# Altium project RTM_4SFP_3QSFP.PrjPcb (part 1 of 2)
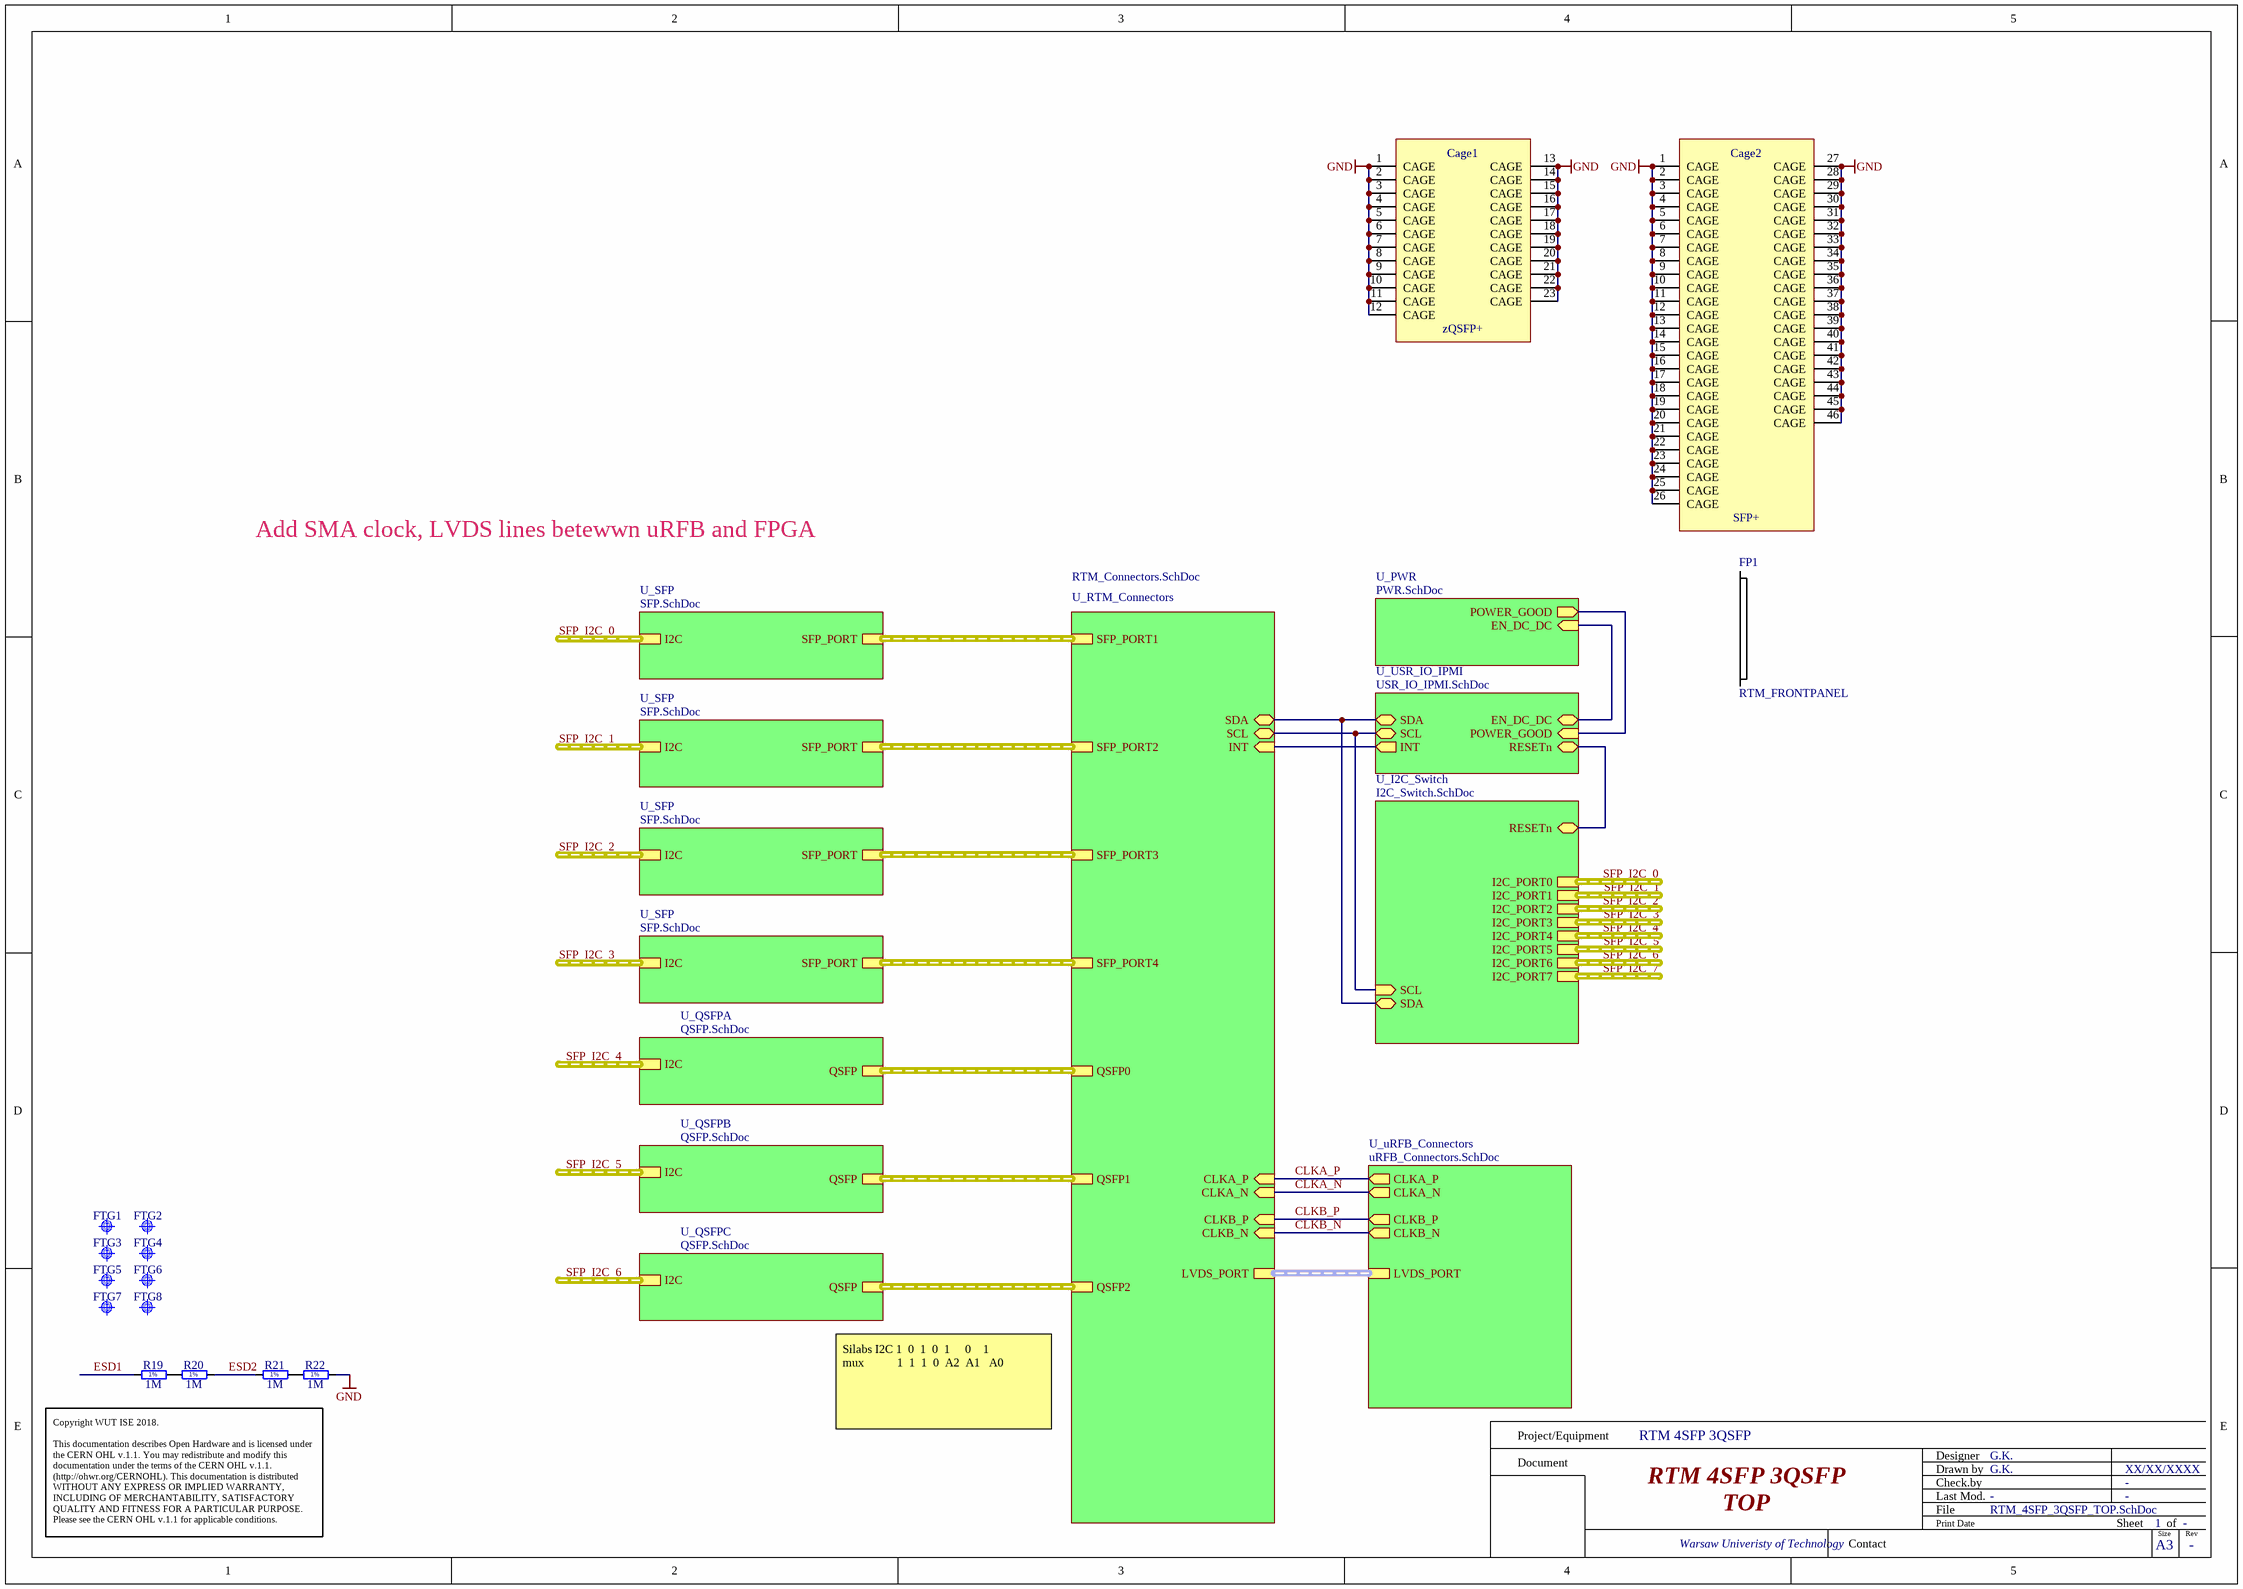
[diagram p0: RTM_4SFP_3QSFP_TOP.SchDoc]
8 sheets, 275 parts. Net scope: hierarchical (ports join the sheet entries above them; power ports are global).
Board file: RTM_4SFP_3QSFP.PcbDoc
Sheets:
  RTM_4SFP_3QSFP_TOP.SchDoc
    U_SFP = SFP.SchDoc
    U_I2C_Switch = I2C_Switch.SchDoc
    U_SFP = SFP.SchDoc
    U_SFP = SFP.SchDoc
    U_SFP = SFP.SchDoc
    U_RTM_Connectors = RTM_Connectors.SchDoc
    U_USR_IO_IPMI = USR_IO_IPMI.SchDoc
    U_uRFB_Connectors = uRFB_Connectors.SchDoc
    U_QSFPA = QSFP.SchDoc
    U_QSFPB = QSFP.SchDoc
    U_QSFPC = QSFP.SchDoc
    U_PWR = PWR.SchDoc

## Sheet RTM_4SFP_3QSFP_TOP.SchDoc: RTM 4SFP 3QSFP
size 420 x 297 mm; Author: G.K.; CompanyName: WUT; DrawnBy: G.K.; Organization: CERN; Address1: Warsaw Univeristy of Technology; Address2: Nowowiejska 15/19; DocumentNumber: 1; Revision: -; SheetNumber: 1; SheetTotal: -; EDA_Number: ARTIQ; Projet: RTM 4SFP 3QSFP; ModifiedBy: -; CreateDate: XX/XX/XXXX; CheckedDate: -; Title2: TOP; DivGrp: ISE; Designer: G.K.; ModifiedDate: -; ProjectName: RTM 4SFP 3QSFP

### Parts
Cage1  zQSFP+  [TYCO_2170737-1]
Cage2  SFP+  [TYCO_2007132-1]
FP1  RTM_FRONTPANEL  [RTM_FRONTPANEL]
FTG1  Use only in PCB  [FIDUCIAL_TOP_S100-200]  (value not drawn)
FTG2  Use only in PCB  [FIDUCIAL_TOP_S100-200]  (value not drawn)
FTG3  Use only in PCB  [FIDUCIAL_TOP_S100-200]  (value not drawn)
FTG4  Use only in PCB  [FIDUCIAL_TOP_S100-200]  (value not drawn)
FTG5  Use only in PCB  [FIDUCIAL_TOP_S100-200]  (value not drawn)
FTG6  Use only in PCB  [FIDUCIAL_TOP_S100-200]  (value not drawn)
FTG7  Use only in PCB  [FIDUCIAL_TOP_S100-200]  (value not drawn)
FTG8  Use only in PCB  [FIDUCIAL_TOP_S100-200]  (value not drawn)
R19  1M  [RESC3216X65N]
R20  1M  [RESC3216X65N]
R21  1M  [RESC3216X65N]
R22  1M  [RESC3216X65N]

### Sub-sheets
U_I2C_Switch = I2C_Switch.SchDoc: I2C_PORT5 (harness I2C), I2C_PORT2 (harness I2C), I2C_PORT1 (harness I2C), I2C_PORT4 (harness I2C), I2C_PORT3 (harness I2C), I2C_PORT7 (harness I2C), I2C_PORT6 (harness I2C), I2C_PORT0 (harness I2C), SDA (bidir), SCL (in), RESETn (bidir)
U_PWR = PWR.SchDoc: POWER_GOOD (out), EN_DC_DC (in)
U_QSFPA = QSFP.SchDoc: QSFP (harness FP), I2C (harness I2C)
U_QSFPB = QSFP.SchDoc: QSFP (harness FP), I2C (harness I2C)
U_QSFPC = QSFP.SchDoc: QSFP (harness FP), I2C (harness I2C)
U_RTM_Connectors = RTM_Connectors.SchDoc: SFP_PORT4 (harness SFP_PORT), SFP_PORT3 (harness SFP_PORT), SFP_PORT2 (harness SFP_PORT), SFP_PORT1 (harness SFP_PORT), SDA (bidir), SCL (bidir), INT (in), QSFP0 (harness FP), QSFP1 (harness FP), QSFP2 (harness FP), CLKA_P (in), CLKA_N (in), CLKB_P (in), CLKB_N (in), LVDS_PORT (harness LVDS_PORT)
U_SFP = SFP.SchDoc: I2C (harness I2C), SFP_PORT (harness SFP_PORT)
U_SFP = SFP.SchDoc: SFP_PORT (harness SFP_PORT), I2C (harness I2C)
U_SFP = SFP.SchDoc: SFP_PORT (harness SFP_PORT), I2C (harness I2C)
U_SFP = SFP.SchDoc: SFP_PORT (harness SFP_PORT), I2C (harness I2C)
U_uRFB_Connectors = uRFB_Connectors.SchDoc: CLKB_P (out), CLKA_N (out), CLKA_P (out), CLKB_N (out), LVDS_PORT (harness LVDS_PORT)
U_USR_IO_IPMI = USR_IO_IPMI.SchDoc: SDA (bidir), SCL (bidir), INT (out), EN_DC_DC (bidir), POWER_GOOD (in), RESETn (bidir)

### Nets
GND: Cage1.1(CAGE) Cage1.2(CAGE) Cage1.3(CAGE) Cage1.4(CAGE) Cage1.5(CAGE) Cage1.6(CAGE) Cage1.7(CAGE) Cage1.8(CAGE) Cage1.9(CAGE) Cage1.10(CAGE) Cage1.11(CAGE) Cage1.12(CAGE) Cage1.13(CAGE) Cage1.14(CAGE) Cage1.15(CAGE) Cage1.16(CAGE) Cage1.17(CAGE) Cage1.18(CAGE) Cage1.19(CAGE) Cage1.20(CAGE) Cage1.21(CAGE) Cage1.22(CAGE) Cage1.23(CAGE) Cage2.1(CAGE) Cage2.2(CAGE) Cage2.3(CAGE) Cage2.4(CAGE) Cage2.5(CAGE) Cage2.6(CAGE) Cage2.7(CAGE) Cage2.8(CAGE) Cage2.9(CAGE) Cage2.10(CAGE) Cage2.11(CAGE) Cage2.12(CAGE) Cage2.13(CAGE) Cage2.14(CAGE) Cage2.15(CAGE) Cage2.16(CAGE) Cage2.17(CAGE) Cage2.18(CAGE) Cage2.19(CAGE) Cage2.20(CAGE) Cage2.21(CAGE) Cage2.22(CAGE) Cage2.23(CAGE) Cage2.24(CAGE) Cage2.25(CAGE) Cage2.26(CAGE) Cage2.27(CAGE) Cage2.28(CAGE) Cage2.29(CAGE) Cage2.30(CAGE) Cage2.31(CAGE) Cage2.32(CAGE) Cage2.33(CAGE) Cage2.34(CAGE) Cage2.35(CAGE) Cage2.36(CAGE) Cage2.37(CAGE) Cage2.38(CAGE) Cage2.39(CAGE) Cage2.40(CAGE) Cage2.41(CAGE) Cage2.42(CAGE) Cage2.43(CAGE) Cage2.44(CAGE) Cage2.45(CAGE) Cage2.46(CAGE) R22.2
CLKA_N: sheet U_RTM_Connectors/CLKA_N, sheet U_uRFB_Connectors/CLKA_N
CLKA_P: sheet U_RTM_Connectors/CLKA_P, sheet U_uRFB_Connectors/CLKA_P
CLKB_N: sheet U_RTM_Connectors/CLKB_N, sheet U_uRFB_Connectors/CLKB_N
CLKB_P: sheet U_RTM_Connectors/CLKB_P, sheet U_uRFB_Connectors/CLKB_P
ESD1: R19.1
ESD2: R20.2 R21.1
I2C_RESETn: sheet U_I2C_Switch/RESETn, sheet U_USR_IO_IPMI/RESETn
SCL: sheet U_I2C_Switch/SCL, sheet U_RTM_Connectors/SCL, sheet U_USR_IO_IPMI/SCL
SDA: sheet U_I2C_Switch/SDA, sheet U_RTM_Connectors/SDA, sheet U_USR_IO_IPMI/SDA
NetD1_2: sheet U_USR_IO_IPMI/EN_DC_DC, sheet U_PWR/EN_DC_DC
NetIC1_37: sheet U_USR_IO_IPMI/POWER_GOOD, sheet U_PWR/POWER_GOOD
NetIC14_13: sheet U_RTM_Connectors/INT, sheet U_USR_IO_IPMI/INT
NetR19_2: R19.2 R20.1
NetR21_2: R21.2 R22.1

### Buses and harness runs
harness SFP_I2C_0 = sheet U_I2C_Switch/I2C_PORT0
harness SFP_I2C_0 = sheet U_SFP/I2C
harness SFP_I2C_1 = sheet U_I2C_Switch/I2C_PORT1
harness SFP_I2C_1 = sheet U_SFP/I2C
harness SFP_I2C_2 = sheet U_I2C_Switch/I2C_PORT2
harness SFP_I2C_2 = sheet U_SFP/I2C
harness SFP_I2C_3 = sheet U_I2C_Switch/I2C_PORT3
harness SFP_I2C_3 = sheet U_SFP/I2C
harness SFP_I2C_4 = sheet U_I2C_Switch/I2C_PORT4
harness SFP_I2C_4 = sheet U_QSFPA/I2C
harness SFP_I2C_5 = sheet U_I2C_Switch/I2C_PORT5
harness SFP_I2C_5 = sheet U_QSFPB/I2C
harness SFP_I2C_6 = sheet U_I2C_Switch/I2C_PORT6
harness SFP_I2C_6 = sheet U_QSFPC/I2C
harness SFP_I2C_7 = sheet U_I2C_Switch/I2C_PORT7
harness sheet U_QSFPA/QSFP = sheet U_RTM_Connectors/QSFP0
harness sheet U_QSFPB/QSFP = sheet U_RTM_Connectors/QSFP1
harness sheet U_QSFPC/QSFP = sheet U_RTM_Connectors/QSFP2
harness sheet U_RTM_Connectors/LVDS_PORT = sheet U_uRFB_Connectors/LVDS_PORT
harness sheet U_RTM_Connectors/SFP_PORT1 = sheet U_SFP/SFP_PORT
harness sheet U_RTM_Connectors/SFP_PORT2 = sheet U_SFP/SFP_PORT
harness sheet U_RTM_Connectors/SFP_PORT3 = sheet U_SFP/SFP_PORT
harness sheet U_RTM_Connectors/SFP_PORT4 = sheet U_SFP/SFP_PORT

### Notes on the sheet
- Add SMA clock, LVDS lines betewwn uRFB and FPGA
- Silabs I2C 1  0  1  0  1     0    1
  mux           1  1  1  0  A2  A1   A0
- Project/Equipment
- Document
- Designer
- Drawn by
- Check.by
- Copyright WUT ISE 2018.
  This documentation describes Open Hardware and is licensed under the CERN OHL v.1.1. You may redistribute and modify this documentation under the terms of the CERN OHL v.1.1. (http://ohwr.org/CERNOHL). This documentation is distributed WITHOUT ANY EXPRESS OR IMPLIED WARRANTY, INCLUDING OF MERCHANTABILITY, SATISFACTORY QUALITY AND FITNESS FOR A PARTICULAR PURPOSE. Please see the CERN OHL v.1.1 for applicable conditions.
- Contact
- File
- Last Mod.
- Print Date
- Sheet
- Size
- A3
- of
- Rev
- (in symbol R1206_1M_1%_0.25W_100PPM) 1%

### Library data of the parts
Cage1 = TYCO_2170737-1: QSFP+ 1x3 Cage (23Pins); Part Description: 1x3 Press Fit zQSFP+/QSFP28 Cage (Quad Small Form-factor Pluggable), Internal/External EMI Springs; Manufacturer: TYCO ELECTRONICS; Part Number: TYCO_2170737-1; Component Kind: Standard; Component Type: Standard; Pin Count: 23; Family: zQSFP+; Mounted: Yes; Socket: No; SMD: No; PressFit: Yes; Sense: No; Status: None; Manufacturer Part Number: 2170737-1; ComponentHeight: 9.65mm; HelpURL: \\cern.ch\dfs\Applications\Altium\Datasheets\TYCO_2170737-1.pdf; Author: CERN DEM JLC; CreateDate: 29.05.2018; LatestRevisionDate: 29.05.2018
Cage2 = TYCO_2007132-1: SFP+  1x4 Cage (46 Pins); Part Description: 1x4 Press Fit Cage For Use with SFP+ Connector (Small Form-factor Pluggable); Manufacturer: TYCO ELECTRONICS; Table: TYCO; Part Number: TYCO_2007132-1; Component Kind: Standard; Component Type: Standard; Pin Count: 46; Family: SFP+; Mounted: Yes; Socket: No; SMD: No; Status: None; Manufacturer Part Number: 2007132-1; ComponentHeight: 9.7mm; HelpURL: \\cern.ch\dfs\Applications\Altium\Datasheets\TYCO_2007132-1.pdf; Author: CERN DEM JLC; CreateDate: 2013-06-04; LatestRevisionDate: 2013-06-12
FP1 = RTM_FRONTPANEL: RTM Frontpanel; Value: RTM_FRONTPANEL
FTG1 FTG3 FTG5 FTG7 = FIDUCIAL_TARGET_S100-200: Fiducial Target; Part Description: Square Fiducial Target, Top Layer, 1.0mm, Top Solder 2.0mm, Keepout =2.0mm; Mounted: No; Table: Pads; Part Number: FIDUCIAL_TARGET_S100-200; Component Kind: Standard (No BOM); Component Type: Standard (No BOM); Pin Count: 1; Family: Fiducial; Socket: No; SMD: Yes; Status: None; ComponentHeight: 0mm; Author: CERN DEM JLC; CreateDate: 2010-02-09; LatestRevisionDate: 2012-04-04; PackageDescription: Square Fiducial Target, Top Layer, 1.0mm, Top Solder 2.0mm, Keepout =2.0mm
FTG2 FTG4 FTG6 FTG8 = FIDUCIAL_TARGET_S100-200: Fiducial Target; Part Description: Square Fiducial Target, Top Layer, 1.0mm, Top Solder 2.0mm, Keepout =2.0mm; Mounted: No; Part Number: FIDUCIAL_TARGET_S100-200; Component Kind: Standard (No BOM); Component Type: Standard (No BOM); Pin Count: 1; Family: Fiducial; Socket: No; SMD: Yes; Status: None; ComponentHeight: 0mm; Author: CERN DEM JLC; CreateDate: 09.02.2010; LatestRevisionDate: 04.04.2012; PackageDescription: Square Fiducial Target, Top Layer, 1.0mm, Top Solder 2.0mm, Keepout =2.0mm; Sense: No; HelpURL: Undefined
R19-R22 = R1206_1M_1%_0.25W_100PPM: Resistor - 1%; Part Description: General Purpose Thick Film Chip Resistor; Manufacturer: GENERIC; Manufacturer1 Part Number: NRC12F1004TRF; Power: 0.25W; TC: ±100ppm/°C; Table: Resistors SMD; Part Number: R1206_1M_1%_0.25W_100PPM; Component Kind: Standard; Component Type: Standard; Pin Count: 2; Value: 1M; Status: Preferred; Tolerance: ±1%; Manufacturer Part Number: R1206_1M_1%_0.25W_100PPM; Case: 1206; Mounted: Yes; Socket: No; SMD: Yes; Manufacturer1 Example: NIC COMPONENT; Manufacturer1 ComponentHeight: 0.65mm; HelpURL: \\cern.ch\dfs\Applications\Altium\Datasheets\R1206_NIC_NRC.pdf; Author: CERN DEM JLC; CreateDate: 2007-12-03; LatestRevisionDate: 2008-03-13

## Sheet SFP.SchDoc: SFP cage
size 420 x 297 mm; Author: G.K.; CompanyName: WUT; DrawnBy: G.K.; Organization: CERN; Address1: Warsaw Univeristy of Technology; Address2: Nowowiejska 15/19; DocumentNumber: 5; Revision: -; SheetNumber: 5; SheetTotal: -; EDA_Number: ARTIQ; Projet: RTM 4SFP 3QSFP; ModifiedBy: -; CreateDate: XX/XX/XXXX; CheckedDate: -; Title2: and I2C control; DivGrp: ISE; Designer: G.K.; ModifiedDate: -; ProjectName: RTM 4SFP 3QSFP
Used 4 times, as channels U_SFP, U_SFP, U_SFP, U_SFP. Parts and nets are listed once, with the designators drawn on the sheet.
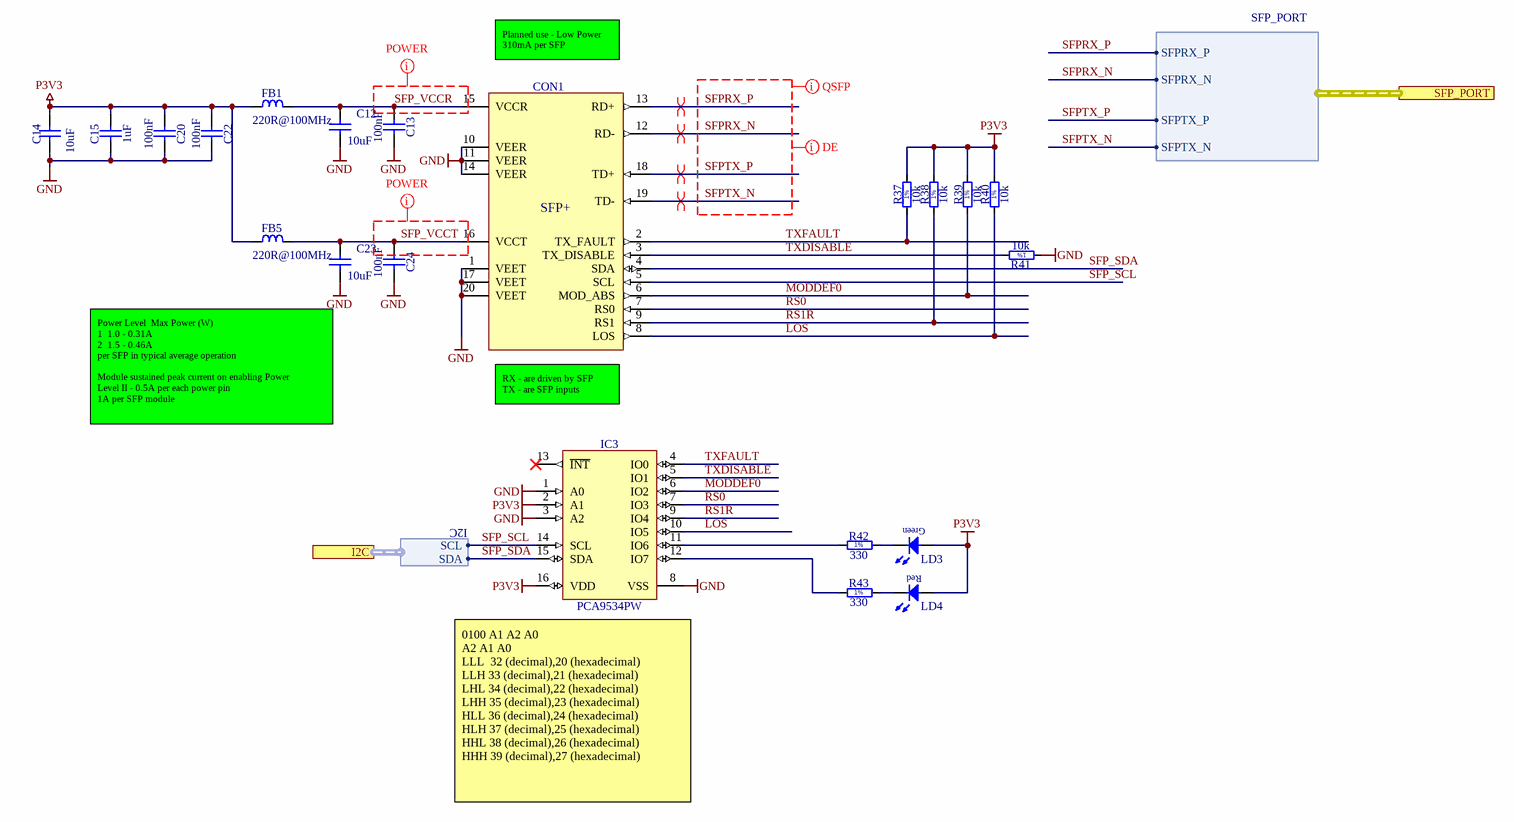
[diagram p1: SFP.SchDoc]

### Parts
C12  10uF  [CAPC2012X135N]
C13  100nF  [CAPC1005X55N]
C14  10uF  [CAPC2012X135N]
C15  1uF  [CAPC1608X87N]
C20  100nF  [CAPC1005X55N]
C22  100nF  [CAPC1005X55N]
C23  10uF  [CAPC2012X135N]
C24  100nF  [CAPC1005X55N]
CON1  1888247-1  [TYCO_1888247-1]  (value not drawn)
FB1  220R@100MHz  [INDC2012X105N]
FB5  220R@100MHz  [INDC2012X105N]
IC3  PCA9534PW  [SOP65P640X110-16N]
LD3  LED_AVAGO_HSME-C120  [LED_AVAGO_HSME-C120]  (value not drawn)
LD4  Red  [LED_AVAGO_HSME-C120rev]  (value not drawn)
R37  10k  [RESC1005X40N]
R38  10k  [RESC1005X40N]
R39  10k  [RESC1005X40N]
R40  10k  [RESC1005X40N]
R41  10k  [RESC1005X40N]
R42  330  [RESC1608X55N]
R43  330  [RESC1608X55N]

### Ports
I2C (harness I2C), SFP_PORT (harness SFP_PORT)

### Harnesses
SFP_PORT: SFPRX_P, SFPRX_N, SFPTX_P, SFPTX_N
I2C: SCL, SDA

### Nets
GND: C12.2 C13.2 C14.2 C15.1 C20.2 C22.2 C23.2 C24.2 CON1.1(VEET) CON1.10(VEER) CON1.11(VEER) CON1.14(VEER) CON1.17(VEET) CON1.20(VEET) IC3.1(A0) IC3.3(A2) IC3.8(VSS) R41.1
P3V3: C14.1 C15.2 C20.1 C22.1 FB1.1 FB5.1 IC3.2(A1) IC3.16(VDD) LD3.2(A) LD4.1(A) R37.2 R38.2 R39.2 R40.2
LOS: CON1.8(LOS) IC3.10(IO5) R40.1
MODDEF0: CON1.6(MOD_ABS) IC3.6(IO2) R39.1
RS0: CON1.7(RS0) IC3.7(IO3)
RS1R: CON1.9(RS1) IC3.9(IO4) R38.1
SFP_SCL: CON1.5(SCL) IC3.14(SCL) ; port I2C.SCL
SFP_SDA: CON1.4(SDA) IC3.15(SDA) ; port I2C.SDA
SFP_VCCR: C12.1 C13.1 CON1.15(VCCR) FB1.2
SFP_VCCT: C23.1 C24.1 CON1.16(VCCT) FB5.2
SFPRX_N: CON1.12(RD-) ; port SFP_PORT.SFPRX_N
SFPRX_P: CON1.13(RD+) ; port SFP_PORT.SFPRX_P
SFPTX_N: CON1.19(TD-) ; port SFP_PORT.SFPTX_N
SFPTX_P: CON1.18(TD+) ; port SFP_PORT.SFPTX_P
TXDISABLE: CON1.3(TX_DISABLE) IC3.5(IO1) R41.2
TXFAULT: CON1.2(TX_FAULT) IC3.4(IO0) R37.1
NetIC3_11: IC3.11(IO6) R42.1
NetIC3_12: IC3.12(IO7) R43.1
NetLD3_1: LD3.1(C) R42.2
NetLD4_2: LD4.2(C) R43.2

Not connected (* = marked no-connect by the designer): IC3 13(~{INT})*

### Channels
U_SFP: designators end in A
U_SFP: designators end in B
U_SFP: designators end in C
U_SFP: designators end in D

### Layout directives
net class POWER: SFP_VCCR, SFP_VCCT
differential pair: GTP1RX_N, GTP1RX_P, GTP1TX_N, GTP1TX_P
net class QSFP: SFPRX_N, SFPRX_P, SFPTX_N, SFPTX_P
net class DE: SFPRX_N, SFPRX_P, SFPTX_N, SFPTX_P

### Notes on the sheet
- (near CON1) Planned use - Low Power
  310mA per SFP
- (near C23) Power Level  Max Power (W)
  1  1.0 - 0.31A
  2  1.5 - 0.46A
  per SFP in typical average operation
  Module sustained peak current on enabling Power
  Level II - 0.5A per each power pin
  1A per SFP module
- (near CON1) RX - are driven by SFP
  TX - are SFP inputs
- (near IC3) 0100 A1 A2 A0
  A2 A1 A0
  LLL 	32 (decimal),20 (hexadecimal)
  LLH	33 (decimal),21 (hexadecimal)
  LHL	34 (decimal),22 (hexadecimal)
  LHH	35 (decimal),23 (hexadecimal)
  HLL	36 (decimal),24 (hexadecimal)
  HLH	37 (decimal),25 (hexadecimal)
  HHL	38 (decimal),26 (hexadecimal)
  HHH	39 (decimal),27 (hexadecimal)
- Project/Equipment
- Document
- Designer
- Drawn by
- Check.by
- Copyright WUT ISE 2018.
  This documentation describes Open Hardware and is licensed under the CERN OHL v.1.1. You may redistribute and modify this documentation under the terms of the CERN OHL v.1.1. (http://ohwr.org/CERNOHL). This documentation is distributed WITHOUT ANY EXPRESS OR IMPLIED WARRANTY, INCLUDING OF MERCHANTABILITY, SATISFACTORY QUALITY AND FITNESS FOR A PARTICULAR PURPOSE. Please see the CERN OHL v.1.1 for applicable conditions.
- Contact
- File
- Last Mod.
- Print Date
- Sheet
- Size
- A3
- of
- Rev
- (in symbol R0402_10K_1%_0.0625W_100PPM) 1%
- (in symbol R0603_330R_1%_0.1W_100PPM) 1%

### Library data of the parts
C12 C14 C23 = CC0805_10UF_10V_10%_X7R: Non-polarised capacitor; Part Description: SMD Multilayer Chip Ceramic Capacitor; Manufacturer: GENERIC; Manufacturer1 Part Number: GRM21BR71A106KE51L; Voltage: 10V; TC: X7R; Tolerance: ±10%; Table: Capacitors SMD; Part Number: CC0805_10UF_10V_10%_X7R; Component Kind: Standard; Component Type: Standard; Pin Count: 2; Value: 10uF; Status: Preferred; Manufacturer Part Number: CC0805_10UF_10V_10%_X7R; Case: 0805; Mounted: Yes; Socket: No; SMD: Yes; Manufacturer1 Example: MURATA; Manufacturer1 ComponentHeight: 1.35mm; HelpURL: \\cern.ch\dfs\Applications\Altium\Datasheets\CC0805_X7R_MURATA.pdf; Author: CERN DEM JLC; CreateDate: 2012-04-30; LatestRevisionDate: 2012-04-30
C13 C20 C22 C24 = CC0402_100NF_16V_10%_X5R: Non-polarised capacitor; Part Description: SMD Multilayer Chip Ceramic Capacitor; Manufacturer: GENERIC; Manufacturer1 Part Number: GRM155R61C104KA88D; Voltage: 16V; TC: X5R; Tolerance: ±10%; Part Number: CC0402_100NF_16V_10%_X5R; Component Kind: Standard; Component Type: Standard; Pin Count: 2; Value: 100nF; Status: None; Manufacturer Part Number: CC0402_100NF_16V_10%_X5R; Case: 0402; Mounted: Yes; Socket: No; SMD: Yes; Manufacturer1 Example: MURATA; Manufacturer1 ComponentHeight: 0.55mm; HelpURL: \\cern.ch\dfs\Applications\Altium\Datasheets\CC0402_X5R_MURATA_GRM.pdf; Author: CERN DEM JLC; CreateDate: 10.12.2013; LatestRevisionDate: 10.12.2013; Sense: No
C15 = CC0603_1UF_25V_10%_X7R: Non-polarised capacitor; Part Description: SMD Multilayer Chip Ceramic Capacitor; Manufacturer: GENERIC; Manufacturer1 Part Number: GRM188R71E105KA12D; Voltage: 25V; TC: X7R; Tolerance: ±10%; Table: Capacitors SMD; Part Number: CC0603_1UF_25V_10%_X7R; Component Kind: Standard; Component Type: Standard; Pin Count: 2; Value: 1uF; Status: None; Manufacturer Part Number: CC0603_1UF_25V_10%_X7R; Case: 0603; Mounted: Yes; Socket: No; SMD: Yes; Manufacturer1 Example: MURATA; Manufacturer1 ComponentHeight: 0.9mm; HelpURL: \\cern.ch\dfs\Applications\Altium\Datasheets\CC0603_X7R_MURATA.pdf; Author: CERN DEM JLC; CreateDate: 2011-01-18; LatestRevisionDate: 2011-01-18
CON1 = TYCO_1888247-1: 20 Position SFP+ Connector (Small Form-factor Pluggable); Part Description: 20 Position, Pitch 0.8mm SFP+  Receptacle (Small Form-factor Pluggable); Manufacturer: TYCO ELECTRONICS; Table: TYCO; Part Number: TYCO_1888247-1; Component Kind: Standard; Component Type: Standard; Pin Count: 20; Family: SFP+; Mounted: Yes; Socket: No; SMD: Yes; Status: None; Manufacturer Part Number: 1888247-1; ComponentHeight: 5.4mm; HelpURL: \\cern.ch\dfs\Applications\Altium\Datasheets\TYCO_1888247-1.pdf; Author: CERN DEM JLC; CreateDate: 2012-02-27; LatestRevisionDate: 2012-02-27
FB1 FB5 = IND0805_MURATA_BLM21PG221SN1D: Inductor; Part Description: SMD EMIFIL Suppression Chip Ferrite Bead; Manufacturer: MURATA; Power: 2A; Resistance: 0.05R; Tolerance: ±25%; Table: Inductors SMD; Part Number: IND0805_MURATA_BLM21PG221SN1D; Component Kind: Standard; Component Type: Standard; Pin Count: 2; Value: 220R@100MHz; Status: None; Manufacturer Part Number: BLM21PG221SN1D; Case: 0805; Mounted: Yes; Socket: No; SMD: Yes; ComponentHeight: 1.05mm; HelpURL: \\cern.ch\dfs\Applications\Altium\Datasheets\IND0402_MURATA_BLM21P.pdf; Author: CERN DEM JLC; CreateDate: 2010-01-25; LatestRevisionDate: 2010-01-25
IC3 = PCA9534PW: 8-Bit I2C-Bus and SMBus Low Power I/O Port with Interrupt; Manufacturer: ANALOG DEVICES; PressFit: No; Bonding: No; Table: Analog & Interface; Part Number: PCA9534PW; Component Kind: Standard; Component Type: Standard; Device: PCA9534PW; PackageDescription: SOP, 0.65mm pitch; 16 pin, 4.40mm W X 5.00mm L X 1.10mm H body IPC Medium Density; Part Description: 8-Bit I2C-Bus and SMBus Low Power I/O Port with Interrupt; Manufacturer Part Number: PCA9534PW; Pin Count: 16; Case: SSOP16; Mounted: Yes; Socket: No; SMD: Yes; ComponentHeight: 1.1mm; Author: CERN DEM JLC; HelpURL: \\cern.ch\dfs\Applications\Altium\Datasheets\PCA9534PW.pdf; CreateDate: 2013-12-18; LatestRevisionDate: 2013-12-18
LD3 = LED_AVAGO_HSME-C120: LED Green 1C 2A; Part Description: High Performance Right Angle Chip Green LED; Manufacturer: AVAGO TECHNOLOGIES; Table: LEDs & Displays; Part Number: LED_AVAGO_HSME-C120; Component Kind: Standard; Component Type: Standard; Color: Green; PackageDescription: Green Chip LED, 2-Leads, Body 1.7x1.1mm, Side Emitting Package; Manufacturer Part Number: HSME-C120; Pin Count: 2; Mounted: Yes; Socket: No; SMD: Yes; ComponentHeight: 0.7mm; HelpURL: \\cern.ch\dfs\Applications\Altium\Datasheets\LED_AVAGO_HSME-C120.pdf; ComponentLink1URL: \\cern.ch\dfs\Applications\Altium\Datasheets\LED_AVAGO_HSME-C110_DESIGN-GUIDE.pdf; ComponentLink1Description: Design Guide; Author: CERN DEM JMW; CreateDate: 2009-07-22; LatestRevisionDate: 2012-06-20
LD4 = LED_SMD_90deg_mini_R: LED Red Avago C120; Part Number: LED_AVAGO_HSMC-C120; Part Description: High Performance Right Angle Chip Red LED; Manufacturer: AVAGO TECHNOLOGIES; Manufacturer Part Number: HSMC-C120; Table: LEDs & Displays; Component Kind: Standard; Component Type: Standard; Color: Red; Footprint: LED_AVAGO_HSMC-C120; PackageDescription: Red Chip LED, 2-Leads, Body 1.7x1.1mm, Side Emitting Package; Pin Count: 2; Mounted: Yes; Socket: No; SMD: Yes; ComponentHeight: 0.7mm; HelpURL: \\cern.ch\dfs\Applications\Altium\Datasheets\LED_AVAGO_HSME-C120.pdf; ComponentLink1URL: \\cern.ch\dfs\Applications\Altium\Datasheets\LED_AVAGO_HSME-C110_DESIGN-GUIDE.pdf; ComponentLink1Description: Design Guide; Author: CERN DEM JMW; CreateDate: 2009-07-22; LatestRevisionDate: 2012-06-20
R37-R41 = R0402_10K_1%_0.0625W_100PPM: Resistor - 1%; Part Description: General Purpose Thick Film Chip Resistor; Manufacturer: GENERIC; Manufacturer1 Part Number: 232270671003L; TC: ±100ppm/°C; Table: Resistors SMD; Part Number: R0402_10K_1%_0.0625W_100PPM; Component Kind: Standard; Component Type: Standard; Pin Count: 2; Value: 10k; Status: Not recommended; Power: 0.0625W; Tolerance: ±1%; Manufacturer Part Number: R0402_10K_1%_0.0625W_100PPM; Case: 0402; Mounted: Yes; Socket: No; SMD: Yes; Manufacturer1 Example: YAGEO PHYCOMP; Manufacturer1 ComponentHeight: 0.4mm; HelpURL: \\cern.ch\dfs\Applications\Altium\Datasheets\R0402_Phycomp_RC0402.pdf; Author: CERN DEM JLC; CreateDate: 2007-12-03; LatestRevisionDate: 2012-10-17
R42 R43 = R0603_330R_1%_0.1W_100PPM: Resistor - 1%; Part Description: General Purpose Thick Film Chip Resistor; Manufacturer: GENERIC; Manufacturer1 Part Number: NRC06F3300TRF; Power: 0.1W; TC: ±100ppm/°C; Table: Resistors SMD; Part Number: R0603_330R_1%_0.1W_100PPM; Component Kind: Standard; Component Type: Standard; Pin Count: 2; Value: 330; Status: Preferred; Tolerance: ±1%; Manufacturer Part Number: R0603_330R_1%_0.1W_100PPM; Case: 0603; Mounted: Yes; Socket: No; SMD: Yes; Manufacturer1 Example: NIC COMPONENT; Manufacturer1 ComponentHeight: 0.55mm; HelpURL: \\cern.ch\dfs\Applications\Altium\Datasheets\R0603_NIC_NRC.pdf; Author: CERN DEM JLC; CreateDate: 2007-12-03; LatestRevisionDate: 2008-03-13

## Sheet I2C_Switch.SchDoc: I2C
size 420 x 297 mm; Author: G.K.; CompanyName: WUT; DrawnBy: G.K.; Organization: CERN; Address1: Warsaw Univeristy of Technology; Address2: Nowowiejska 15/19; DocumentNumber: 2; Revision: -; SheetNumber: 2; SheetTotal: -; EDA_Number: ARTIQ; Projet: RTM 4SFP 3QSFP; ModifiedBy: -; CreateDate: XX/XX/XXXX; CheckedDate: -; Title2: non blobking switch; DivGrp: ISE; Designer: G.K.; ModifiedDate: -; ProjectName: RTM 4SFP 3QSFP
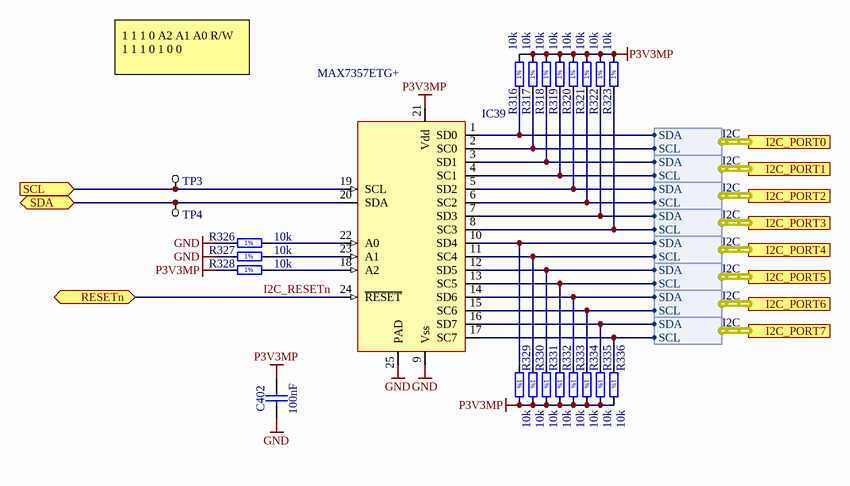
[diagram p2: I2C_Switch.SchDoc]

### Parts
C402  100nF  [CAPC0603X33N]
IC39  MAX7357ETG+  [HVQFN24]
R316  10k  [RESC1005X40N]
R317  10k  [RESC1005X40N]
R318  10k  [RESC1005X40N]
R319  10k  [RESC1005X40N]
R320  10k  [RESC1005X40N]
R321  10k  [RESC1005X40N]
R322  10k  [RESC1005X40N]
R323  10k  [RESC1005X40N]
R326  10k  [RESC1005X40N]
R327  10k  [RESC1005X40N]
R328  10k  [RESC1005X40N]
R329  10k  [RESC1005X40N]
R330  10k  [RESC1005X40N]
R331  10k  [RESC1005X40N]
R332  10k  [RESC1005X40N]
R333  10k  [RESC1005X40N]
R334  10k  [RESC1005X40N]
R335  10k  [RESC1005X40N]
R336  10k  [RESC1005X40N]
TP3  TP  [TP]  (value not drawn)
TP4  TP  [TP]  (value not drawn)

### Ports
I2C_PORT0 (harness I2C), I2C_PORT1 (harness I2C), I2C_PORT2 (harness I2C), I2C_PORT3 (harness I2C), I2C_PORT4 (harness I2C), I2C_PORT5 (harness I2C), I2C_PORT6 (harness I2C), I2C_PORT7 (harness I2C), RESETn (bidir), SCL (in), SDA (bidir)

### Harnesses
I2C: SCL, SDA

### Nets
GND: C402.1 IC39.9(Vss) IC39.25(PAD) R326.1 R327.1
P3V3MP: C402.2 IC39.21(Vdd) R316.2 R317.2 R318.2 R319.2 R320.2 R321.2 R322.2 R323.2 R328.1 R329.2 R330.2 R331.2 R332.2 R333.2 R334.2 R335.2 R336.2
I2C_RESETn: IC39.24(~{RESET}) ; port RESETn
QSFP_SCL: IC39.11(SC4) R330.1 ; port I2C_PORT4.SCL
QSFP_SCL: IC39.13(SC5) R332.1 ; port I2C_PORT5.SCL  [a separate net that carries the same name]
QSFP_SCL: IC39.15(SC6) R334.1 ; port I2C_PORT6.SCL  [a separate net that carries the same name]
QSFP_SDA: IC39.10(SD4) R329.1 ; port I2C_PORT4.SDA
QSFP_SDA: IC39.12(SD5) R331.1 ; port I2C_PORT5.SDA  [a separate net that carries the same name]
QSFP_SDA: IC39.14(SD6) R333.1 ; port I2C_PORT6.SDA  [a separate net that carries the same name]
SCL: IC39.19(SCL) TP3.1 ; port SCL
SDA: IC39.20(SDA) TP4.1 ; port SDA
SFP_I2C_0.SCL: IC39.2(SC0) R317.1 ; port I2C_PORT0.SCL
SFP_I2C_0.SDA: IC39.1(SD0) R316.1 ; port I2C_PORT0.SDA
SFP_I2C_1.SCL: IC39.4(SC1) R319.1 ; port I2C_PORT1.SCL
SFP_I2C_1.SDA: IC39.3(SD1) R318.1 ; port I2C_PORT1.SDA
SFP_I2C_2.SCL: IC39.6(SC2) R321.1 ; port I2C_PORT2.SCL
SFP_I2C_2.SDA: IC39.5(SD2) R320.1 ; port I2C_PORT2.SDA
SFP_I2C_3.SCL: IC39.8(SC3) R323.1 ; port I2C_PORT3.SCL
SFP_I2C_3.SDA: IC39.7(SD3) R322.1 ; port I2C_PORT3.SDA
SFP_I2C_7.SCL: IC39.17(SC7) R336.1 ; port I2C_PORT7.SCL
SFP_I2C_7.SDA: IC39.16(SD7) R335.1 ; port I2C_PORT7.SDA
NetIC39_18: IC39.18(A2) R328.2
NetIC39_22: IC39.22(A0) R326.2
NetIC39_23: IC39.23(A1) R327.2

### Notes on the sheet
- 1 1 1 0 A2 A1 A0 R/W
  1 1 1 0 1 0 0
- Project/Equipment
- Document
- Designer
- Drawn by
- Check.by
- Copyright WUT ISE 2018.
  This documentation describes Open Hardware and is licensed under the CERN OHL v.1.1. You may redistribute and modify this documentation under the terms of the CERN OHL v.1.1. (http://ohwr.org/CERNOHL). This documentation is distributed WITHOUT ANY EXPRESS OR IMPLIED WARRANTY, INCLUDING OF MERCHANTABILITY, SATISFACTORY QUALITY AND FITNESS FOR A PARTICULAR PURPOSE. Please see the CERN OHL v.1.1 for applicable conditions.
- Contact
- File
- Last Mod.
- Print Date
- Sheet
- Size
- A3
- of
- Rev
- (in symbol R0402_10K_1%_0.0625W_100PPM) 1%

### Library data of the parts
C402 = CC0201_100NF_6.3V_10%_X5R: Non-polarised capacitor; Part Description: SMD Multilayer Chip Ceramic Capacitor; Manufacturer: GENERIC; Manufacturer1 Part Number: 02016D104KAT2A; Voltage: 6.3V; TC: X5R; Tolerance: ±10%; Table: Capacitors SMD; Part Number: CC0201_100NF_6.3V_10%_X5R; Component Kind: Standard; Component Type: Standard; Pin Count: 2; Value: 100nF; Status: Not Recommended; Manufacturer Part Number: CC0201_100NF_6.3V_10%_X5R; Case: 0201; Mounted: Yes; Socket: No; SMD: Yes; Manufacturer1 Example: AVX; Manufacturer1 ComponentHeight: 0.33mm; HelpURL: \\cern.ch\dfs\Applications\Altium\Datasheets\CC0201_X5R_AVX.pdf; Author: CERN DEM JLC; CreateDate: 2007-12-03; LatestRevisionDate: 2007-12-03
IC39 = IIC_MUX_MAX7357ETG+: 8-channel I2C-bus multiplexer with reset, INT and timeout
R316-R323 R326-R336 = R0402_10K_1%_0.0625W_100PPM: as R37 on sheet SFP; Part Number: R0402_10K_1%_0.0625W_100PPM; Component Kind: Standard; Component Type: Standard; Pin Count: 2; Value: 10k; Status: Not recommended; Power: 0.0625W; Tolerance: ±1%; Manufacturer Part Number: R0402_10K_1%_0.0625W_100PPM; Case: 0402; Mounted: Yes; Socket: No; SMD: Yes; Manufacturer1 Example: YAGEO PHYCOMP; Manufacturer1 ComponentHeight: 0.4mm; HelpURL: \\cern.ch\dfs\Applications\Altium\Datasheets\R0402_Phycomp_RC0402.pdf; Author: CERN DEM JLC; CreateDate: 2007-12-03; LatestRevisionDate: 2012-10-17
TP3 TP4 = TP: Testpoint

## Sheet RTM_Connectors.SchDoc: RTM
size 420 x 297 mm; Author: G.K.; CompanyName: WUT; DrawnBy: G.K.; Organization: CERN; Address1: Warsaw Univeristy of Technology; Address2: Nowowiejska 15/19; DocumentNumber: 4; Revision: -; SheetNumber: 4; SheetTotal: -; EDA_Number: ARTIQ; Projet: RTM 4SFP 3QSFP; ModifiedBy: -; CreateDate: XX/XX/XXXX; CheckedDate: -; Title2: connector; DivGrp: ISE; Designer: G.K.; ModifiedDate: -; ProjectName: RTM 4SFP 3QSFP
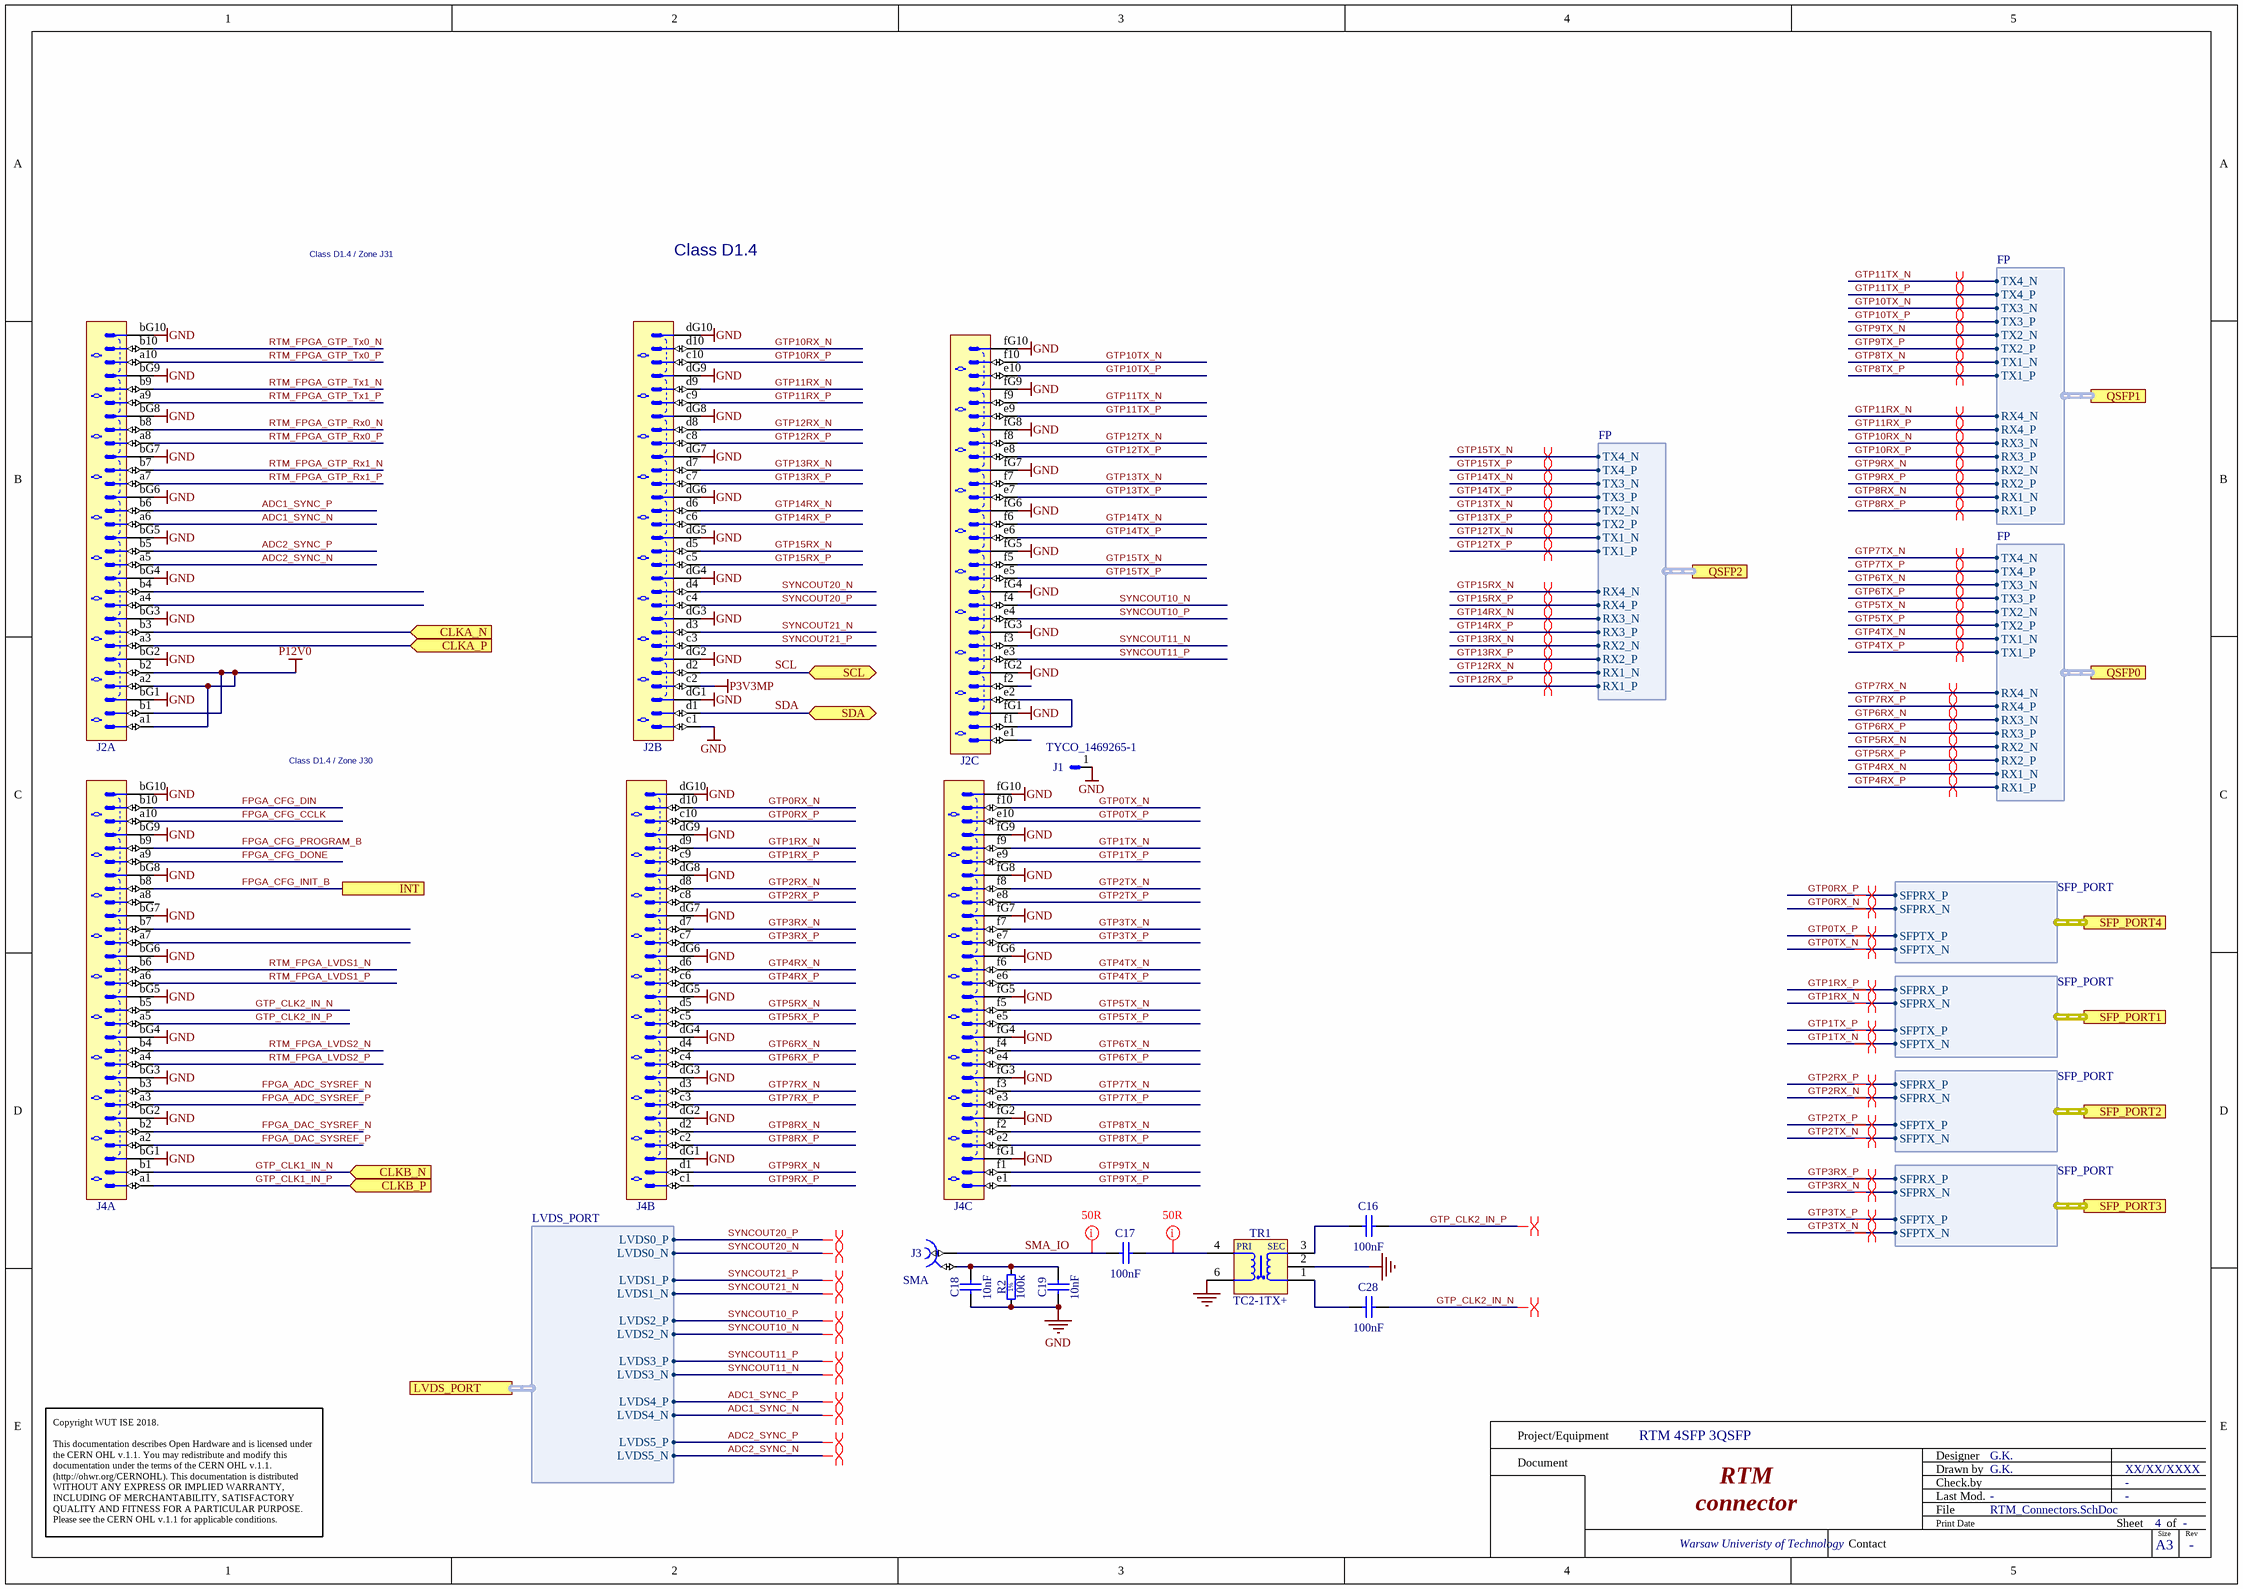
[diagram p3: RTM_Connectors.SchDoc]

### Parts
C16  100nF  [CAPC0603X33N]
C17  100nF  [CAPC0603X33N]
C18  10nF  [CAPC1005X55N]
C19  10nF  [CAPC1005X55N]
C28  100nF  [CAPC0603X33N]
J1  TYCO_1469265-1  [TYCO_1469265-1]
J2  Advanced TCA  [TYCO_6469183-1]  (value not drawn)  (parts A,B,C of 3)
J3  SMA  [AMPHENOL_132203]
J4  Advanced TCA  [TYCO_6469183-1]  (value not drawn)  (parts A,B,C of 3)
R2  100k  [RESC1005X40N]
TR1  TC2-1TX+  [XFMR_MINI-CIRCUITS_AT1521]

### Ports
CLKA_N (in), CLKA_P (in), CLKB_N (in), CLKB_P (in), INT (in), LVDS_PORT (harness LVDS_PORT), QSFP0 (harness FP), QSFP1 (harness FP), QSFP2 (harness FP), SCL (bidir), SDA (bidir), SFP_PORT1 (harness SFP_PORT), SFP_PORT2 (harness SFP_PORT), SFP_PORT3 (harness SFP_PORT), SFP_PORT4 (harness SFP_PORT)

### Harnesses
SFP_PORT: SFPRX_P, SFPRX_N, SFPTX_P, SFPTX_N
FP: RX1_P, RX1_N, RX2_N, RX2_P, TX1_P, TX1_N, TX2_N, TX2_P, RX3_P, RX3_N, RX4_N, RX4_P, TX3_P, TX3_N, TX4_N, TX4_P
LVDS_PORT: LVDS0_P, LVDS0_N, LVDS1_P, LVDS1_N, LVDS2_P, LVDS2_N, LVDS3_P, LVDS3_N, LVDS4_P, LVDS4_N, LVDS5_P, LVDS5_N

### Nets
GND: C18.1 C19.1 J1.1 J2.bG1 J2.bG2 J2.bG3 J2.bG4 J2.bG5 J2.bG6 J2.bG7 J2.bG8 J2.bG9 J2.bG10 J2.c1 J2.dG1 J2.dG2 J2.dG3 J2.dG4 J2.dG5 J2.dG6 J2.dG7 J2.dG8 J2.dG9 J2.dG10 J2.fG1 J2.fG2 J2.fG3 J2.fG4 J2.fG5 J2.fG6 J2.fG7 J2.fG8 J2.fG9 J2.fG10 J4.bG1 J4.bG2 J4.bG3 J4.bG4 J4.bG5 J4.bG6 J4.bG7 J4.bG8 J4.bG9 J4.bG10 J4.dG1 J4.dG2 J4.dG3 J4.dG4 J4.dG5 J4.dG6 J4.dG7 J4.dG8 J4.dG9 J4.dG10 J4.fG1 J4.fG2 J4.fG3 J4.fG4 J4.fG5 J4.fG6 J4.fG7 J4.fG8 J4.fG9 J4.fG10 R2.1 TR1.2(NU) TR1.6(PDOT)
P3V3MP: J2.c2
P12V0: J2.a1 J2.a2 J2.b1 J2.b2
ADC1_SYNC_N: J2.a6 ; port LVDS_PORT.LVDS4_N
ADC1_SYNC_P: J2.b6 ; port LVDS_PORT.LVDS4_P
ADC2_SYNC_N: J2.a5 ; port LVDS_PORT.LVDS5_N
ADC2_SYNC_P: J2.b5 ; port LVDS_PORT.LVDS5_P
CLKA_N: J2.b3 ; port CLKA_N
CLKA_P: J2.a3 ; port CLKA_P
FPGA_ADC_SYSREF_N: J4.b3
FPGA_ADC_SYSREF_P: J4.a3
FPGA_CFG_CCLK: J4.a10
FPGA_CFG_DIN: J4.b10
FPGA_CFG_DONE: J4.a9
FPGA_CFG_INIT_B: J4.b8
FPGA_CFG_PROGRAM_B: J4.b9
FPGA_DAC_SYSREF_N: J4.b2
FPGA_DAC_SYSREF_P: J4.a2
GTP0RX_N: J4.d10 ; port SFP_PORT4.SFPRX_N
GTP0RX_P: J4.c10 ; port SFP_PORT4.SFPRX_P
GTP0TX_N: J4.f10 ; port SFP_PORT4.SFPTX_N
GTP0TX_P: J4.e10 ; port SFP_PORT4.SFPTX_P
GTP1RX_N: J4.d9 ; port SFP_PORT1.SFPRX_N
GTP1RX_P: J4.c9 ; port SFP_PORT1.SFPRX_P
GTP1TX_N: J4.f9 ; port SFP_PORT1.SFPTX_N
GTP1TX_P: J4.e9 ; port SFP_PORT1.SFPTX_P
GTP2RX_N: J4.d8 ; port SFP_PORT2.SFPRX_N
GTP2RX_P: J4.c8 ; port SFP_PORT2.SFPRX_P
GTP2TX_N: J4.f8 ; port SFP_PORT2.SFPTX_N
GTP2TX_P: J4.e8 ; port SFP_PORT2.SFPTX_P
GTP3RX_N: J4.d7 ; port SFP_PORT3.SFPRX_N
GTP3RX_P: J4.c7 ; port SFP_PORT3.SFPRX_P
GTP3TX_N: J4.f7 ; port SFP_PORT3.SFPTX_N
GTP3TX_P: J4.e7 ; port SFP_PORT3.SFPTX_P
GTP4RX_N: J4.d6 ; port QSFP0.RX1_N
GTP4RX_P: J4.c6 ; port QSFP0.RX1_P
GTP4TX_N: J4.f6 ; port QSFP0.TX1_N
GTP4TX_P: J4.e6 ; port QSFP0.TX1_P
GTP5RX_N: J4.d5 ; port QSFP0.RX2_N
GTP5RX_P: J4.c5 ; port QSFP0.RX2_P
GTP5TX_N: J4.f5 ; port QSFP0.TX2_N
GTP5TX_P: J4.e5 ; port QSFP0.TX2_P
GTP6RX_N: J4.d4 ; port QSFP0.RX3_N
GTP6RX_P: J4.c4 ; port QSFP0.RX3_P
GTP6TX_N: J4.f4 ; port QSFP0.TX3_N
GTP6TX_P: J4.e4 ; port QSFP0.TX3_P
GTP7RX_N: J4.d3 ; port QSFP0.RX4_N
GTP7RX_P: J4.c3 ; port QSFP0.RX4_P
GTP7TX_N: J4.f3 ; port QSFP0.TX4_N
GTP7TX_P: J4.e3 ; port QSFP0.TX4_P
GTP8RX_N: J4.d2 ; port QSFP1.RX1_N
GTP8RX_P: J4.c2 ; port QSFP1.RX1_P
GTP8TX_N: J4.f2 ; port QSFP1.TX1_N
GTP8TX_P: J4.e2 ; port QSFP1.TX1_P
GTP9RX_N: J4.d1 ; port QSFP1.RX2_N
GTP9RX_P: J4.c1 ; port QSFP1.RX2_P
GTP9TX_N: J4.f1 ; port QSFP1.TX2_N
GTP9TX_P: J4.e1 ; port QSFP1.TX2_P
GTP10RX_N: J2.d10 ; port QSFP1.RX3_N
GTP10RX_P: J2.c10 ; port QSFP1.RX3_P
GTP10TX_N: J2.f10 ; port QSFP1.TX3_N
GTP10TX_P: J2.e10 ; port QSFP1.TX3_P
GTP11RX_N: J2.d9 ; port QSFP1.RX4_N
GTP11RX_P: J2.c9 ; port QSFP1.RX4_P
GTP11TX_N: J2.f9 ; port QSFP1.TX4_N
GTP11TX_P: J2.e9 ; port QSFP1.TX4_P
GTP12RX_N: J2.d8 ; port QSFP2.RX1_N
GTP12RX_P: J2.c8 ; port QSFP2.RX1_P
GTP12TX_N: J2.f8 ; port QSFP2.TX1_N
GTP12TX_P: J2.e8 ; port QSFP2.TX1_P
GTP13RX_N: J2.d7 ; port QSFP2.RX2_N
GTP13RX_P: J2.c7 ; port QSFP2.RX2_P
GTP13TX_N: J2.f7 ; port QSFP2.TX2_N
GTP13TX_P: J2.e7 ; port QSFP2.TX2_P
GTP14RX_N: J2.d6 ; port QSFP2.RX3_N
GTP14RX_P: J2.c6 ; port QSFP2.RX3_P
GTP14TX_N: J2.f6 ; port QSFP2.TX3_N
GTP14TX_P: J2.e6 ; port QSFP2.TX3_P
GTP15RX_N: J2.d5 ; port QSFP2.RX4_N
GTP15RX_P: J2.c5 ; port QSFP2.RX4_P
GTP15TX_N: J2.f5 ; port QSFP2.TX4_N
GTP15TX_P: J2.e5 ; port QSFP2.TX4_P
GTP_CLK1_IN_N: J4.b1 ; port CLKB_N  [project net CLKB_N]
GTP_CLK1_IN_P: J4.a1 ; port CLKB_P  [project net CLKB_P]
GTP_CLK2_IN_N: C28.2 J4.b5
GTP_CLK2_IN_P: C16.2 J4.a5
RTM_FPGA_GTP_Rx0_N: J2.b8
RTM_FPGA_GTP_Rx0_P: J2.a8
RTM_FPGA_GTP_Rx1_N: J2.b7
RTM_FPGA_GTP_Rx1_P: J2.a7
RTM_FPGA_GTP_Tx0_N: J2.b10
RTM_FPGA_GTP_Tx0_P: J2.a10
RTM_FPGA_GTP_Tx1_N: J2.b9
RTM_FPGA_GTP_Tx1_P: J2.a9
RTM_FPGA_LVDS1_N: J4.b6
RTM_FPGA_LVDS1_P: J4.a6
RTM_FPGA_LVDS2_N: J4.b4
RTM_FPGA_LVDS2_P: J4.a4
SCL: J2.d2 ; port SCL
SDA: J2.d1 ; port SDA
SMA_IO: C17.1 J3.1
SYNCOUT10_N: J2.f4 ; port LVDS_PORT.LVDS2_N  [project net LVDS2_N]
SYNCOUT10_P: J2.e4 ; port LVDS_PORT.LVDS2_P  [project net LVDS2_P]
SYNCOUT11_N: J2.f3 ; port LVDS_PORT.LVDS3_N  [project net LVDS3_N]
SYNCOUT11_P: J2.e3 ; port LVDS_PORT.LVDS3_P  [project net LVDS3_P]
SYNCOUT20_N: J2.d4 ; port LVDS_PORT.LVDS0_N  [project net LVDS0_N]
SYNCOUT20_P: J2.c4 ; port LVDS_PORT.LVDS0_P  [project net LVDS0_P]
SYNCOUT21_N: J2.d3 ; port LVDS_PORT.LVDS1_N  [project net LVDS1_N]
SYNCOUT21_P: J2.c3 ; port LVDS_PORT.LVDS1_P  [project net LVDS1_P]
NetC16_1: C16.1 TR1.3(S)
NetC17_2: C17.2 TR1.4(P)
NetC18_2: C18.2 C19.2 J3.2 R2.2
NetC28_1: C28.1 TR1.1(SDOT)
NetJ2_e2: J2.e2 J2.f1

Not connected (* = marked no-connect by the designer): J2 a4 b4 e1 f2; J4 a7 a8 b7

### Layout directives
differential pair: GTP0RX_N, GTP0RX_P, GTP0TX_N, GTP0TX_P, GTP1RX_N, GTP1RX_P, GTP1TX_N, GTP1TX_P, GTP2RX_N, GTP2RX_P, GTP2TX_N, GTP2TX_P, GTP3RX_N, GTP3RX_P, GTP3TX_N, GTP3TX_P, GTP4RX_N, GTP4RX_P, GTP4TX_N, GTP4TX_P, GTP5RX_N, GTP5RX_P, GTP5TX_N, GTP5TX_P, GTP6RX_N, GTP6RX_P, GTP6TX_N, GTP6TX_P, GTP7RX_N, GTP7RX_P, GTP7TX_N, GTP7TX_P, GTP8RX_N, GTP8RX_P, GTP8TX_N, GTP8TX_P, GTP9RX_N, GTP9RX_P, GTP9TX_N, GTP9TX_P, GTP10RX_N, GTP10RX_P, GTP10TX_N, GTP10TX_P, GTP11RX_N, GTP11RX_P, GTP11TX_N, GTP11TX_P, GTP12RX_N, GTP12RX_P, GTP12TX_N, GTP12TX_P, GTP13RX_N, GTP13RX_P, GTP13TX_N, GTP13TX_P, GTP14RX_N, GTP14RX_P, GTP14TX_N, GTP14TX_P, GTP15RX_N, GTP15RX_P, GTP15TX_N, GTP15TX_P
differential pair; net class Diff_100Ohm: ADC1_SYNC_N, ADC1_SYNC_P, ADC2_SYNC_N, ADC2_SYNC_P, GTP_CLK2_IN_N, GTP_CLK2_IN_P, LVDS0_N, LVDS0_P, LVDS1_N, LVDS1_P, LVDS2_N, LVDS2_P, LVDS3_N, LVDS3_P
net class 50R: NetC17_2, SMA_IO

### Notes on the sheet
- Class D1.4 / Zone J31
- Class D1.4
- Class D1.4 / Zone J30
- Project/Equipment
- Document
- Designer
- Drawn by
- Check.by
- Copyright WUT ISE 2018.
  This documentation describes Open Hardware and is licensed under the CERN OHL v.1.1. You may redistribute and modify this documentation under the terms of the CERN OHL v.1.1. (http://ohwr.org/CERNOHL). This documentation is distributed WITHOUT ANY EXPRESS OR IMPLIED WARRANTY, INCLUDING OF MERCHANTABILITY, SATISFACTORY QUALITY AND FITNESS FOR A PARTICULAR PURPOSE. Please see the CERN OHL v.1.1 for applicable conditions.
- Contact
- File
- Last Mod.
- Print Date
- Sheet
- Size
- A3
- of
- Rev
- (in symbol R0402_100K_1%_0.0625W_100PPM) 1%
- (in symbol XFMR_MINI-CIRCUITS_TC2-1TX+) PRI; SEC

### Library data of the parts
C16 C17 C28 = CC0201_100NF_6.3V_10%_X5R: Non-polarised capacitor; Part Description: SMD Multilayer Chip Ceramic Capacitor; Manufacturer: GENERIC; Manufacturer1 Part Number: 02016D104KAT2A; Voltage: 6.3V; TC: X5R; Tolerance: ±10%; Part Number: CC0201_100NF_6.3V_10%_X5R; Component Kind: Standard; Component Type: Standard; Pin Count: 2; Value: 100nF; Status: Not Recommended; Manufacturer Part Number: CC0201_100NF_6.3V_10%_X5R; Case: 0201; Mounted: Yes; Socket: No; SMD: Yes; Sense: No; Manufacturer1 Example: AVX; Manufacturer1 ComponentHeight: 0.33mm; HelpURL: \\cern.ch\dfs\Applications\Altium\Datasheets\CC0201_X5R_AVX.pdf; Author: CERN DEM JLC; CreateDate: 2007-12-03; LatestRevisionDate: 2007-12-03
C18 C19 = CC0402_10NF_16V_10%_X7R: Non-polarised capacitor; Part Description: SMD Multilayer Chip Ceramic Capacitor; Manufacturer: GENERIC; Manufacturer1 Part Number: 223878715636; Voltage: 16V; TC: X7R; Tolerance: ±10%; Part Number: CC0402_10NF_16V_10%_X7R; Component Kind: Standard; Component Type: Standard; Pin Count: 2; Value: 10nF; Status: Not Recommended; Manufacturer Part Number: CC0402_10NF_16V_10%_X7R; Case: 0402; Mounted: Yes; Socket: No; SMD: Yes; Sense: No; Manufacturer1 Example: PHYCOMP; Manufacturer1 ComponentHeight: 0.55mm; HelpURL: \\cern.ch\dfs\Applications\Altium\Datasheets\CC0402_X7R_PHYCOMP.pdf; Author: CERN DEM JLC; CreateDate: 03.12.2007; LatestRevisionDate: 03.12.2007
J1 = TYCO_1469265-1: Single Pin Male; Part Number: TYCO_1469265-1
J2 J4 = TYCO_6469183-1: Connector 60 ATCA Male 30 Pairs (60 Signals) + 3x10 Ground; Part Description: 60 Positions, Pitch 2.5mm,  Advanced TCA, Z-PACK HM-Zd Right Angle Press Fit Header; Manufacturer: TYCO ELECTRONICS; Part Number: TYCO_6469183-1; Component Kind: Standard; Component Type: Standard; Pin Count: 90; Family: Advanced TCA; Mounted: Yes; Socket: No; SMD: No; PressFit: Yes; Sense: No; Status: None; Manufacturer Part Number: 6469183-1; ComponentHeight: 13.31mm; HelpURL: \\cern.ch\dfs\Applications\Altium\Datasheets\TYCO_6469183-1.pdf; Author: CERN DEM JLC; CreateDate: 28.08.2013; LatestRevisionDate: 28.08.2013
J3 = AMPHENOL_132203: Part Description: 50 Ohm Through Hole SMA Right Angle PCB Jack; Manufacturer Part Number: 132203; PressFit: No; Part Number: AMPHENOL_132203; Component Kind: Standard; Component Type: Standard; Pin Count: 5; Family: SMA; Mounted: Yes; Socket: No; SMD: No; Sense: No; Status: None; Manufacturer: AMPHENOL; ComponentHeight: 10.44mm; HelpURL: \\cern.ch\dfs\Applications\Altium\Datasheets\AMPHENOL_132203.pdf; Author: CERN DEM MR; CreateDate: 2016-10-06; LatestRevisionDate: 2016-10-06; ClassName: Connectors
R2 = R0402_100K_1%_0.0625W_100PPM: Resistor - 1%; Part Description: General Purpose Thick Film Chip Resistor; Manufacturer: GENERIC; Manufacturer1 Part Number: 232270671004L; PressFit: No; TC: ±100ppm/°C; Part Number: R0402_100K_1%_0.0625W_100PPM; Component Kind: Standard; Component Type: Standard; Pin Count: 2; Value: 100k; Status: Not Recommended; Manufacturer Part Number: R0402_100K_1%_0.0625W_100PPM; Case: 0402; Mounted: Yes; Sense: No; Socket: No; SMD: Yes; Manufacturer1 Example: YAGEO PHYCOMP; Manufacturer1 ComponentHeight: 0.4mm; HelpURL: \\cern.ch\dfs\Applications\Altium\Datasheets\R0402_Phycomp_RC0402.pdf; Author: CERN DEM JLC; CreateDate: 03.12.2007; LatestRevisionDate: 17.10.2012; Power: 0.0625W; Tolerance: ±1%
TR1 = XFMR_MINI-CIRCUITS_TC2-1TX+: 50 Ohm 3 to 300MHz RF Transformers; Manufacturer: MINI-CIRCUITS; Manufacturer Part Number: TC2-1TX+; HelpURL: https://ww2.minicircuits.com/pdfs/TC2-1TX+.pdf

## Sheet USR_IO_IPMI.SchDoc: IPMI
size 420 x 297 mm; Author: G.K.; CompanyName: WUT; DrawnBy: G.K.; Organization: CERN; Address1: Warsaw Univeristy of Technology; Address2: Nowowiejska 15/19; DocumentNumber: 6; Revision: -; SheetNumber: 6; SheetTotal: -; EDA_Number: ARTIQ; Projet: RTM 4SFP 3QSFP; ModifiedBy: -; CreateDate: XX/XX/XXXX; CheckedDate: -; Title2: and thermometers; DivGrp: ISE; Designer: G.K.; ModifiedDate: -; ProjectName: RTM 4SFP 3QSFP
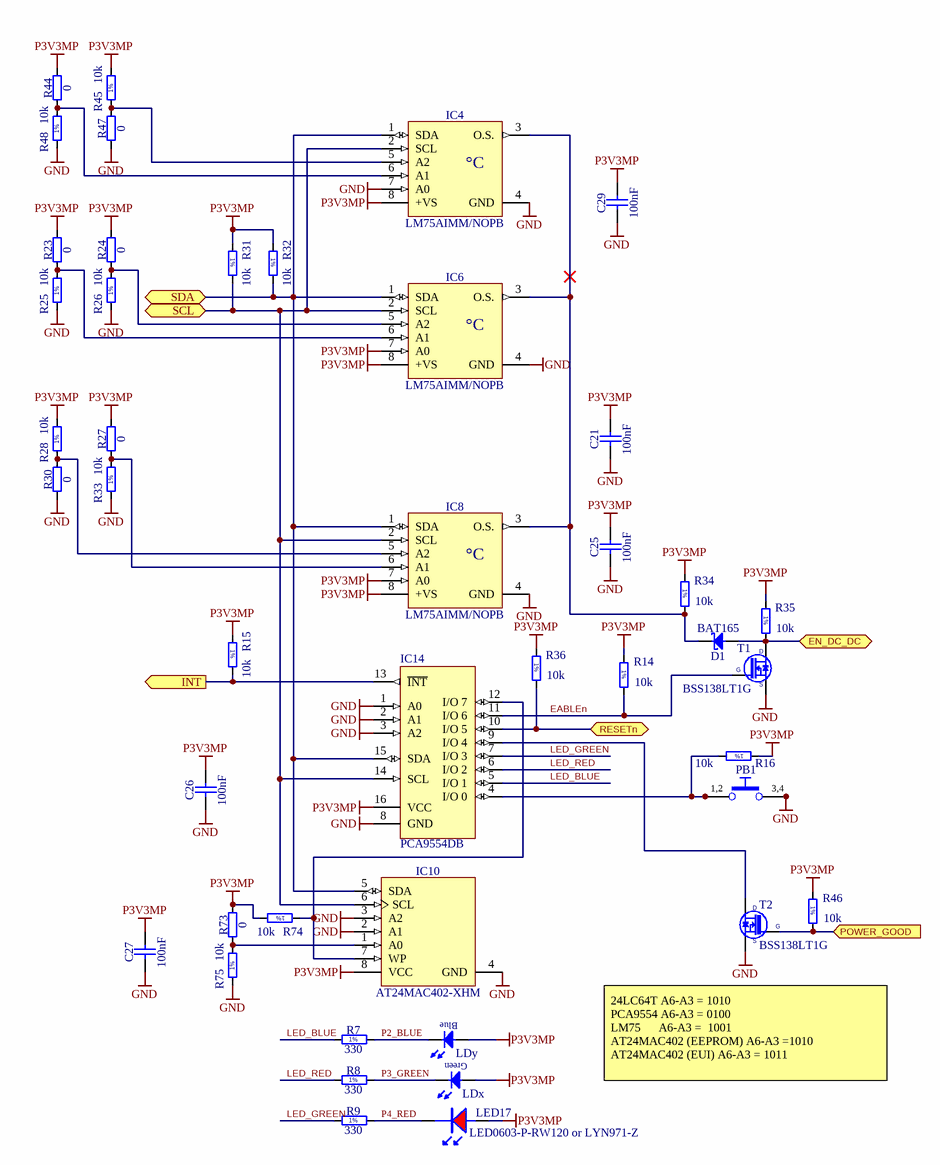
[diagram p4: USR_IO_IPMI.SchDoc]

### Parts
C21  100nF  [CAPC1005X55N]
C25  100nF  [CAPC1005X55N]
C26  100nF  [CAPC1005X55N]
C27  100nF  [CAPC1005X55N]
C29  100nF  [CAPC1005X55N]
D1  BAT165  [SOD2512X110N]
IC4  LM75AIMM/NOPB  [SOP65P490X109-8N]
IC6  LM75AIMM/NOPB  [SOP65P490X109-8N]
IC8  LM75AIMM/NOPB  [SOP65P490X109-8N]
IC10  AT24MAC402-XHM  [SOP65P640X120-8N]
IC14  PCA9554DB  [SOP65P640X120-16N]
LDx  Green  [LED_AVAGO_HSME-C120rev]  (value not drawn)
LDy  Blue  [LED_AVAGO_HSME-C120rev]  (value not drawn)
LED17  LED0603-P-RW120 or LYN971-Z  [led_0603R]
PB1  Push Button  [SW_C&K_HDT0001]  (value not drawn)
R7  330  [RESC1608X55N]
R8  330  [RESC1608X55N]
R9  330  [RESC1608X55N]
R14  10k  [RESC1005X40N]
R15  10k  [RESC1005X40N]
R16  10k  [RESC1005X40N]
R23  0  [RESC1608X55N]
R24  0  [RESC1608X55N]
R25  10k  [RESC1005X40N]
R26  10k  [RESC1005X40N]
R27  0  [RESC1608X55N]
R28  10k  [RESC1005X40N]
R30  0  [RESC1608X55N]
R31  10k  [RESC1005X40N]
R32  10k  [RESC1005X40N]
R33  10k  [RESC1005X40N]
R34  10k  [RESC1005X40N]
R35  10k  [RESC1005X40N]
R36  10k  [RESC1005X40N]
R44  0  [RESC1608X55N]
R45  10k  [RESC1005X40N]
R46  10k  [RESC1005X40N]
R47  0  [RESC1608X55N]
R48  10k  [RESC1005X40N]
R73  0  [RESC1608X55N]
R74  10k  [RESC1005X40N]
R75  10k  [RESC1005X40N]
T1  BSS138LT1G  [SOT95P240X110-3N]
T2  BSS138LT1G  [SOT95P240X110-3N]

### Ports
EN_DC_DC (bidir), INT (out), POWER_GOOD (in), RESETn (bidir), SCL (bidir), SDA (bidir)

### Nets
GND: C21.2 C25.2 C26.2 C27.2 C29.2 IC4.4(GND) IC4.7(A0) IC6.4(GND) IC8.4(GND) IC10.2(A1) IC10.3(A2) IC10.4(GND) IC14.1(A0) IC14.2(A1) IC14.3(A2) IC14.8(GND) PB1.3 PB1.4 R25.1 R26.1 R30.1 R33.1 R47.1 R48.1 R75.1 T1.2(S) T2.2(S)
P3V3MP: C21.1 C25.1 C26.1 C27.1 C29.1 IC4.8(+VS) IC6.7(A0) IC6.8(+VS) IC8.7(A0) IC8.8(+VS) IC10.8(VCC) IC14.16(VCC) LDx.1(A) LDy.1(A) LED17.A R14.1 R15.1 R16.1 R23.2 R24.2 R27.2 R28.2 R31.1 R32.1 R34.1 R35.1 R36.1 R44.2 R45.2 R46.1 R73.2 R74.2
EABLEn: IC14.11(I/O_6) R14.2 T1.1(G)
I2C_RESETn: IC14.10(I/O_5) R36.2 ; port RESETn
LED_BLUE: IC14.5(I/O_1) R7.1
LED_GREEN: IC14.7(I/O_3) R9.1
LED_RED: IC14.6(I/O_2) R8.1
P2_BLUE: LDy.2(C) R7.2
P3_GREEN: LDx.2(C) R8.2
P4_RED: LED17.K R9.2
SCL: IC4.2(SCL) IC6.2(SCL) IC8.2(SCL) IC10.6(SCL) IC14.14(SCL) R31.2 ; port SCL
SDA: IC4.1(SDA) IC6.1(SDA) IC8.1(SDA) IC10.5(SDA) IC14.15(SDA) R32.2 ; port SDA
NetD1_1: D1.1(C) IC4.3(O.S.) IC6.3(O.S.) IC8.3(O.S.) R34.2
NetD1_2: D1.2(A) R35.2 T1.3(D) ; port EN_DC_DC
NetIC1_37: R46.2 T2.1(G) ; port POWER_GOOD
NetIC4_5: IC4.5(A2) R45.1 R47.2
NetIC4_6: IC4.6(A1) R44.1 R48.2
NetIC6_5: IC6.5(A2) R24.1 R26.2
NetIC6_6: IC6.6(A1) R23.1 R25.2
NetIC8_5: IC8.5(A2) R28.1 R30.2
NetIC8_6: IC8.6(A1) R27.1 R33.2
NetIC10_1: IC10.1(A0) R73.1 R75.2
NetIC10_7: IC10.7(WP) IC14.12(I/O_7) R74.1
NetIC14_4: IC14.4(I/O_0) PB1.1 PB1.2 R16.2
NetIC14_9: IC14.9(I/O_4) T2.3(D)
NetIC14_13: IC14.13(~{INT}) R15.2 ; port INT

### Notes on the sheet
- 24LC64T A6-A3 = 1010
  PCA9554 A6-A3 = 0100
  LM75      A6-A3 =  1001
  AT24MAC402 (EEPROM) A6-A3 =1010
  AT24MAC402 (EUI) A6-A3 = 1011
- Project/Equipment
- Document
- Designer
- Drawn by
- Check.by
- Copyright WUT ISE 2018.
  This documentation describes Open Hardware and is licensed under the CERN OHL v.1.1. You may redistribute and modify this documentation under the terms of the CERN OHL v.1.1. (http://ohwr.org/CERNOHL). This documentation is distributed WITHOUT ANY EXPRESS OR IMPLIED WARRANTY, INCLUDING OF MERCHANTABILITY, SATISFACTORY QUALITY AND FITNESS FOR A PARTICULAR PURPOSE. Please see the CERN OHL v.1.1 for applicable conditions.
- Contact
- File
- Last Mod.
- Print Date
- Sheet
- Size
- A3
- of
- Rev
- (in symbol LM75AIMM/NOPB) °C
- (in symbol R0402_10K_1%_0.0625W_100PPM) 1%
- (in symbol R0603_330R_1%_0.1W_100PPM) 1%
- (in symbol SW_C&K_HDT0001) 1,2; 3,4

### Library data of the parts
C21 C25-C27 C29 = CC0402_100NF_16V_10%_X7R: Non-polarised capacitor; Part Description: SMD Multilayer Chip Ceramic Capacitor; Manufacturer: GENERIC; Manufacturer1 Part Number: 223878715649; Voltage: 16V; TC: X7R; Tolerance: ±10%; Table: Capacitors SMD; Part Number: CC0402_100NF_16V_10%_X7R; Component Kind: Standard; Component Type: Standard; Pin Count: 2; Value: 100nF; Status: Not Recommended; Manufacturer Part Number: CC0402_100NF_16V_10%_X7R; Case: 0402; Mounted: Yes; Socket: No; SMD: Yes; Manufacturer1 Example: PHYCOMP; Manufacturer1 ComponentHeight: 0.55mm; HelpURL: \\cern.ch\dfs\Applications\Altium\Datasheets\CC0402_X7R_PHYCOMP.pdf; Author: CERN DEM JLC; CreateDate: 12/3/2007; LatestRevisionDate: 12/3/2007
D1 = BAT165: Schottky Diode; Manufacturer: INFINEON; Part Description: Medium Power AF Schottky Diode; Voltage: 40V; Power: 750mA; PressFit: No; Bonding: No; Manufacturer Part Number: BAT165; PackageDescription: Small Outline Diode (SOD-323), 1.70mm W X 1.25mm L X 1.10mm H body,  IPC Medium Density; Part Number: BAT165; Component Kind: Standard; Component Type: Standard; Device: BAT165; Pin Count: 2; Case: SOD323; Mounted: Yes; Socket: No; SMD: Yes; Sense: No; ComponentHeight: 1.1mm; HelpURL: \\cern.ch\dfs\Applications\Altium\Datasheets\BAT165.pdf; Author: CERN DEM JLC; CreateDate: 12.11.2014; LatestRevisionDate: 12.11.2014
IC4 IC6 IC8 = LM75AIMM/NOPB: Digital Temperature Sensor and Thermal Watchdog with Two-Wire Interface; Manufacturer: TEXAS INSTRUMENTS; Part Description: -25° to +100°C ±2°C Digital Temperature Sensor and Thermal Watchdog with Two-Wire Interface; PressFit: No; Bonding: No; Manufacturer Part Number: LM75AIMM/NOPB; PackageDescription: SOP, 0.65mm pitch; 8 pin,3.00mm W X 3.00mm L X 1.09mm H bodyI, PC Medium Density; Part Number: LM75AIMM/NOPB; Component Kind: Standard; Component Type: Standard; Device: LM75AIMM/NOPB; Pin Count: 8; Case: SSOP8; Mounted: Yes; Socket: No; SMD: Yes; Sense: No; ComponentHeight: 1.09mm; HelpURL: \\cern.ch\dfs\Applications\Altium\Datasheets\LM75AIMM-NOPB.pdf; Author: CERN DEM JLC; CreateDate: 15.10.2012; LatestRevisionDate: 15.10.2012
IC10 = AT24MAC402-XHM: 1.7V to 5.5V, I2C-Compatible (2-wire) 2-Kbit (256 x 8) Serial EEPROM; Manufacturer: ATMEL; Part Description: 1.7V to 5.5V, I2C-Compatible (2-wire) 2-Kbit (256 x 8) Serial EEPROM with a EUI-48 Address; PressFit: No; Bonding: No; Footprint: SOP65X640X120-8N; Manufacturer Part Number: AT24MAC402-XHM; PackageDescription: SOP, 0.65mm pitch; 8 pin, 4.40mm W X 3.00mm L X 1.20mm H body, IPC Medium Density; Part Number: AT24MAC402-XHM; Component Kind: Standard; Component Type: Standard; Device: AT24MAC402-XHM; Pin Count: 8; Case: TSSOP8; Mounted: Yes; Socket: No; SMD: Yes; Sense: No; ComponentHeight: 1.2mm; HelpURL: \\cern.ch\dfs\Applications\Altium\Datasheets\AT24MAC402-XHM.pdf; Author: CERN DEM MR; CreateDate: 09.03.2016; LatestRevisionDate: 09.11.2016
IC14 = PCA9554D: 8-bit I2C-bus SMBus I/O port with interrupt; Manufacturer1 PN: PCA9554D,112; Manufacturer1: NXP Semiconductors; Distributor1: Digikey; Distributor1 PN: 568-1053-5-ND
LDx = LED_SMD_90deg_mini_G: LED Green Avago C120; Part Number: LED_AVAGO_HSME-C120; Part Description: High Performance Right Angle Chip Green LED; Manufacturer: AVAGO TECHNOLOGIES; Manufacturer Part Number: HSME-C120; Table: LEDs & Displays; Component Kind: Standard; Component Type: Standard; Color: Green; Footprint: LED_AVAGO_HSME-C120; PackageDescription: Green Chip LED, 2-Leads, Body 1.7x1.1mm, Side Emitting Package; Pin Count: 2; Mounted: Yes; Socket: No; SMD: Yes; ComponentHeight: 0.7mm; HelpURL: \\cern.ch\dfs\Applications\Altium\Datasheets\LED_AVAGO_HSME-C120.pdf; ComponentLink1URL: \\cern.ch\dfs\Applications\Altium\Datasheets\LED_AVAGO_HSME-C110_DESIGN-GUIDE.pdf; ComponentLink1Description: Design Guide; Author: CERN DEM JMW; CreateDate: 2009-07-22; LatestRevisionDate: 2012-06-20
LDy = LED_SMD_90deg_mini_B: LED Blue Avago C120; Part Number: LED_AVAGO_HSMR-C120; Part Description: High Performance Right Angle Chip Blue LED; Manufacturer: AVAGO TECHNOLOGIES; Manufacturer Part Number: HSMR-C120; Table: LEDs & Displays; Component Kind: Standard; Component Type: Standard; Color: Blue; Footprint: LED_AVAGO_HSMR-C120; PackageDescription: Blue Chip LED, 2-Leads, Body 1.7x1.1mm, Side Emitting Package; Pin Count: 2; Mounted: Yes; Socket: No; SMD: Yes; ComponentHeight: 0.7mm; HelpURL: \\cern.ch\dfs\Applications\Altium\Datasheets\LED_AVAGO_HSME-C120.pdf; ComponentLink1URL: \\cern.ch\dfs\Applications\Altium\Datasheets\LED_AVAGO_HSME-C110_DESIGN-GUIDE.pdf; ComponentLink1Description: Design Guide; Author: CERN DEM JMW; CreateDate: 2009-07-22; LatestRevisionDate: 2012-06-20
LED17 = LED_0603R: LED 0603 red; Supplier 1: Newark; Supplier Part Number 1: 22M3004; Supplier 2: Newark; Supplier Part Number 2: 20M0618
PB1 = SW_C&K_HDT0001: Push-Button Switch SPDT; Part Description: 5VDC 1mA SPST-NO Micro Mini Surface Surface Mount Detect Push-Button Switch, HDT Serie; Manufacturer: C&K; Table: Switches; Part Number: SW_C&K_HDT0001; Component Kind: Standard; Component Type: Standard; Pin Count: 4; PackageDescription: Body 3.5x2.8mm, Micro Mini Surface Mount Detect Switches, HDT Serie; Family: Push Button; Mounted: Yes; Socket: No; SMD: Yes; Status: None; Manufacturer Part Number: HDT0001; ComponentHeight: 3.35mm; HelpURL: \\cern.ch\dfs\Applications\Altium\Datasheets\SW_C&K_HDT0001.pdf; Author: CERN DEM JLC; CreateDate: 2012-08-15; LatestRevisionDate: 2012-08-15
R7-R9 = R0603_330R_1%_0.1W_100PPM: as R42 on sheet SFP; Part Number: R0603_330R_1%_0.1W_100PPM; Component Kind: Standard; Component Type: Standard; Pin Count: 2; Value: 330; Status: Preferred; Tolerance: ±1%; Manufacturer Part Number: R0603_330R_1%_0.1W_100PPM; Case: 0603; Mounted: Yes; Socket: No; SMD: Yes; Manufacturer1 Example: NIC COMPONENT; Manufacturer1 ComponentHeight: 0.55mm; HelpURL: \\cern.ch\dfs\Applications\Altium\Datasheets\R0603_NIC_NRC.pdf; Author: CERN DEM JLC; CreateDate: 2007-12-03; LatestRevisionDate: 2008-03-13
R14-R16 R25 R26 R28 R31-R36 R45 R46 R48 R74 R75 = R0402_10K_1%_0.0625W_100PPM: as R37 on sheet SFP; Part Number: R0402_10K_1%_0.0625W_100PPM; Component Kind: Standard; Component Type: Standard; Pin Count: 2; Value: 10k; Status: Not recommended; Power: 0.0625W; Tolerance: ±1%; Manufacturer Part Number: R0402_10K_1%_0.0625W_100PPM; Case: 0402; Mounted: Yes; Socket: No; SMD: Yes; Manufacturer1 Example: YAGEO PHYCOMP; Manufacturer1 ComponentHeight: 0.4mm; HelpURL: \\cern.ch\dfs\Applications\Altium\Datasheets\R0402_Phycomp_RC0402.pdf; Author: CERN DEM JLC; CreateDate: 2007-12-03; LatestRevisionDate: 2012-10-17
R23 R24 R27 R30 R44 R47 R73 = R0603_0R_JUMPER: Resistor; Part Description: 1A (0.05R Max DC Resistance) Zero Ohm Jumper; Manufacturer: GENERIC; Manufacturer1 Part Number: NRC06Z0; PressFit: No; Part Number: R0603_0R_JUMPER; Component Kind: Standard; Component Type: Standard; Pin Count: 2; Value: 0; Status: Preferred; Manufacturer Part Number: R0603_0R_JUMPER; Case: 0603; Mounted: Yes; Sense: No; Socket: No; SMD: Yes; Manufacturer1 Example: NIC COMPONENT; Manufacturer1 ComponentHeight: 0.55mm; HelpURL: \\cern.ch\dfs\Applications\Altium\Datasheets\R0603_NIC_NRC.pdf; Author: CERN DEM JLC; CreateDate: 03.12.2007; LatestRevisionDate: 13.03.2008
T1 T2 = BSS138LT1G: N-CHANNEL MOSFET WITH DIODE; Part Description: 50V 200mA N-Channel Enhancement Mode Field-Effect Transistor; Manufacturer: ON SEMICONDUCTOR; PressFit: No; Bonding: No; Part Number: BSS138LT1G; Component Kind: Standard; Component Type: Standard; Device: BSS138LT1G; PackageDescription: SOT23 3-Leads, Pitch 0.95mm - Body 1.4x3mm, IPC Medium Density; Manufacturer Part Number: BSS138LT1G; Pin Count: 3; Case: SOT23-3; Mounted: Yes; Socket: No; SMD: Yes; Sense: No; ComponentHeight: 1.11mm; HelpURL: \\cern.ch\dfs\Applications\Altium\Datasheets\BSS138LT1G.pdf; Author: CERN DEM JLC; CreateDate: 23.03.2009; LatestRevisionDate: 23.03.2009